# EAGLE schematic boardv2fpga (EAGLE 6.6.0)

## Sheet 1 of 11
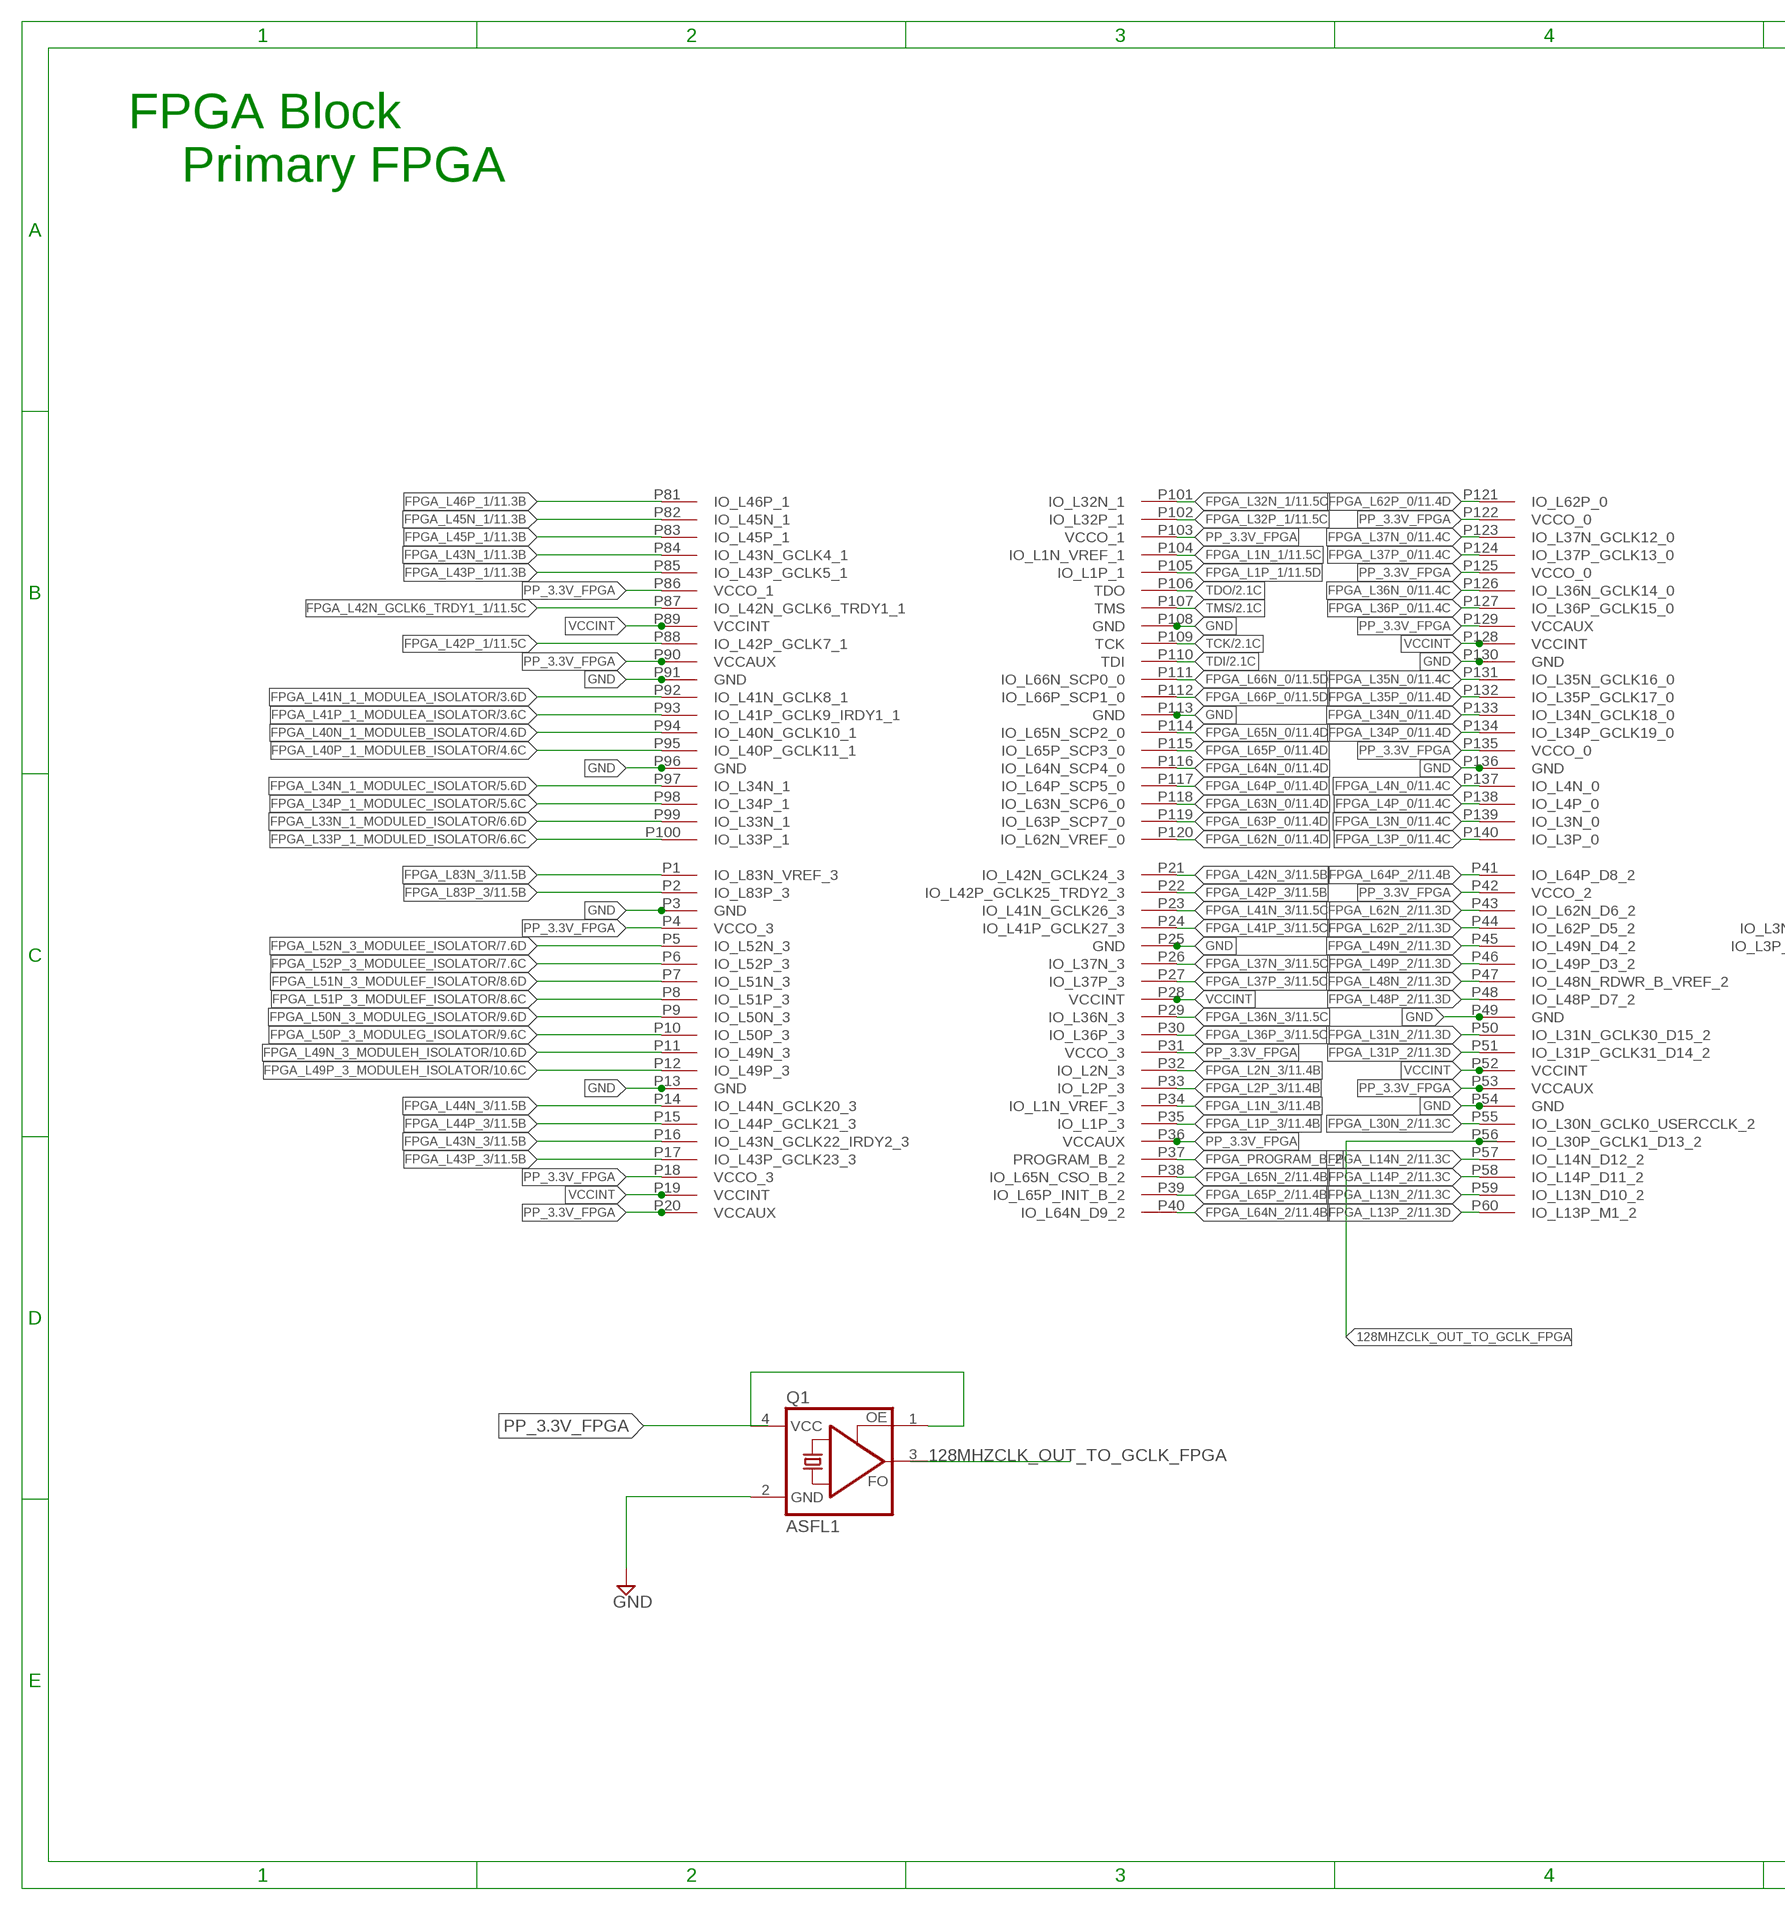
[diagram p0: schematic, sheet 1, part 1 of 2]
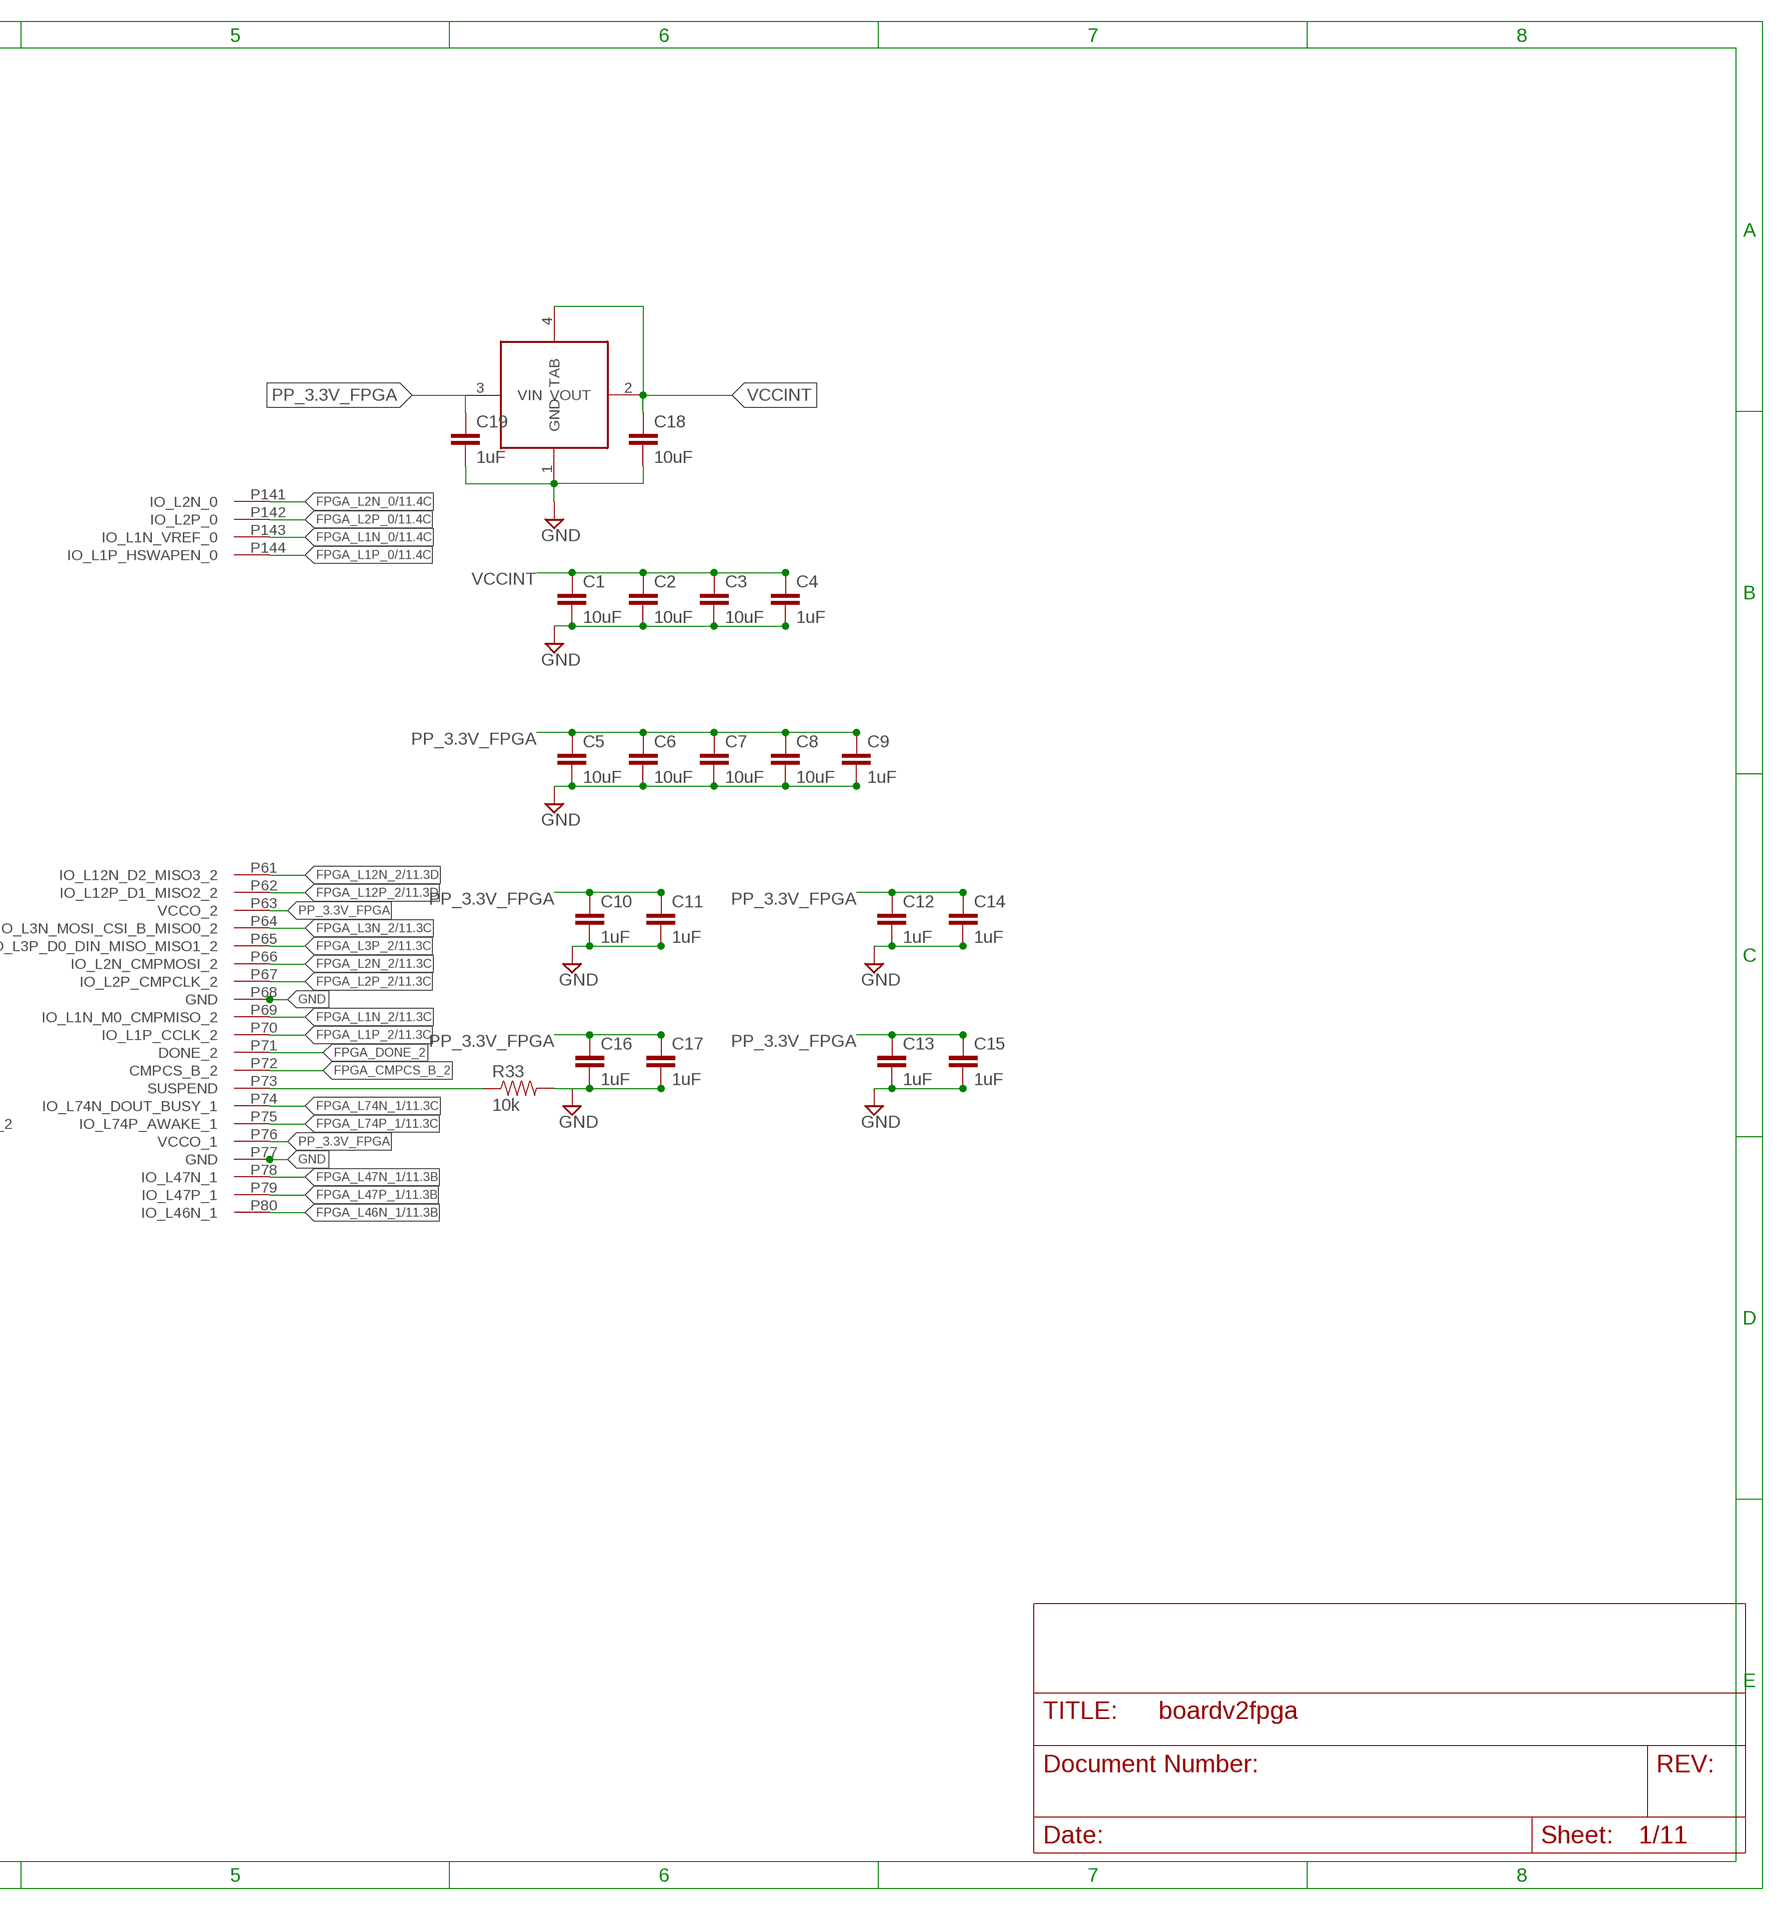
[diagram p1: schematic, sheet 1, part 2 of 2]

### Parts
C1  10uF  CAP0603-CAP  [0603-CAP]
C2  10uF  CAP0603-CAP  [0603-CAP]
C3  10uF  CAP0603-CAP  [0603-CAP]
C4  1uF  CAP0603-CAP  [0603-CAP]
C5  10uF  CAP0603-CAP  [0603-CAP]
C6  10uF  CAP0603-CAP  [0603-CAP]
C7  10uF  CAP0603-CAP  [0603-CAP]
C8  10uF  CAP0603-CAP  [0603-CAP]
C9  1uF  CAP0603-CAP  [0603-CAP]
C10  1uF  CAP0603-CAP  [0603-CAP]
C11  1uF  CAP0603-CAP  [0603-CAP]
C12  1uF  CAP0603-CAP  [0603-CAP]
C13  1uF  CAP0603-CAP  [0603-CAP]
C14  1uF  CAP0603-CAP  [0603-CAP]
C15  1uF  CAP0603-CAP  [0603-CAP]
C16  1uF  CAP0603-CAP  [0603-CAP]
C17  1uF  CAP0603-CAP  [0603-CAP]
C18  10uF  CAP0603-CAP  [0603-CAP]
C19  1uF  CAP0603-CAP  [0603-CAP]
Q1  ASFL1  [ASF]
R33  10k  RESISTOR0603-RES  [0603-RES]
U$1  XC6SLX4-2TQG144C  [TQ144]
U$3  1.2VREG  [SOT-223]

### Nets
128MHZCLK_OUT_TO_GCLK_FPGA: U$1.P56(IO_L30P_GCLK1_D13_2)
FPGA_CMPCS_B_2: U$1.P72(CMPCS_B_2)
FPGA_DONE_2: U$1.P71(DONE_2)
FPGA_L1N_0: U$1.P143(IO_L1N_VREF_0) ; also sheet 11
FPGA_L1N_1: U$1.P104(IO_L1N_VREF_1) ; also sheet 11
FPGA_L1N_2: U$1.P69(IO_L1N_M0_CMPMISO_2) ; also sheet 11
FPGA_L1N_3: U$1.P34(IO_L1N_VREF_3) ; also sheet 11
FPGA_L1P_0: U$1.P144(IO_L1P_HSWAPEN_0) ; also sheet 11
FPGA_L1P_1: U$1.P105(IO_L1P_1) ; also sheet 11
FPGA_L1P_2: U$1.P70(IO_L1P_CCLK_2) ; also sheet 11
FPGA_L1P_3: U$1.P35(IO_L1P_3) ; also sheet 11
FPGA_L2N_0: U$1.P141(IO_L2N_0) ; also sheet 11
FPGA_L2N_2: U$1.P66(IO_L2N_CMPMOSI_2) ; also sheet 11
FPGA_L2N_3: U$1.P32(IO_L2N_3) ; also sheet 11
FPGA_L2P_0: U$1.P142(IO_L2P_0) ; also sheet 11
FPGA_L2P_2: U$1.P67(IO_L2P_CMPCLK_2) ; also sheet 11
FPGA_L2P_3: U$1.P33(IO_L2P_3) ; also sheet 11
FPGA_L3N_0: U$1.P139(IO_L3N_0) ; also sheet 11
FPGA_L3N_2: U$1.P64(IO_L3N_MOSI_CSI_B_MISO0_2) ; also sheet 11
FPGA_L3P_0: U$1.P140(IO_L3P_0) ; also sheet 11
FPGA_L3P_2: U$1.P65(IO_L3P_D0_DIN_MISO_MISO1_2) ; also sheet 11
FPGA_L4N_0: U$1.P137(IO_L4N_0) ; also sheet 11
FPGA_L4P_0: U$1.P138(IO_L4P_0) ; also sheet 11
FPGA_L12N_2: U$1.P61(IO_L12N_D2_MISO3_2) ; also sheet 11
FPGA_L12P_2: U$1.P62(IO_L12P_D1_MISO2_2) ; also sheet 11
FPGA_L13N_2: U$1.P59(IO_L13N_D10_2) ; also sheet 11
FPGA_L13P_2: U$1.P60(IO_L13P_M1_2) ; also sheet 11
FPGA_L14N_2: U$1.P57(IO_L14N_D12_2) ; also sheet 11
FPGA_L14P_2: U$1.P58(IO_L14P_D11_2) ; also sheet 11
FPGA_L30N_2: U$1.P55(IO_L30N_GCLK0_USERCCLK_2) ; also sheet 11
FPGA_L31N_2: U$1.P50(IO_L31N_GCLK30_D15_2) ; also sheet 11
FPGA_L31P_2: U$1.P51(IO_L31P_GCLK31_D14_2) ; also sheet 11
FPGA_L32N_1: U$1.P101(IO_L32N_1) ; also sheet 11
FPGA_L32P_1: U$1.P102(IO_L32P_1) ; also sheet 11
FPGA_L33N_1_MODULED_ISOLATOR: U$1.P99(IO_L33N_1) ; also sheet 6
FPGA_L33P_1_MODULED_ISOLATOR: U$1.P100(IO_L33P_1) ; also sheet 6
FPGA_L34N_0: U$1.P133(IO_L34N_GCLK18_0) ; also sheet 11
FPGA_L34N_1_MODULEC_ISOLATOR: U$1.P97(IO_L34N_1) ; also sheet 5
FPGA_L34P_0: U$1.P134(IO_L34P_GCLK19_0) ; also sheet 11
FPGA_L34P_1_MODULEC_ISOLATOR: U$1.P98(IO_L34P_1) ; also sheet 5
FPGA_L35N_0: U$1.P131(IO_L35N_GCLK16_0) ; also sheet 11
FPGA_L35P_0: U$1.P132(IO_L35P_GCLK17_0) ; also sheet 11
FPGA_L36N_0: U$1.P126(IO_L36N_GCLK14_0) ; also sheet 11
FPGA_L36N_3: U$1.P29(IO_L36N_3) ; also sheet 11
FPGA_L36P_0: U$1.P127(IO_L36P_GCLK15_0) ; also sheet 11
FPGA_L36P_3: U$1.P30(IO_L36P_3) ; also sheet 11
FPGA_L37N_0: U$1.P123(IO_L37N_GCLK12_0) ; also sheet 11
FPGA_L37N_3: U$1.P26(IO_L37N_3) ; also sheet 11
FPGA_L37P_0: U$1.P124(IO_L37P_GCLK13_0) ; also sheet 11
FPGA_L37P_3: U$1.P27(IO_L37P_3) ; also sheet 11
FPGA_L40N_1_MODULEB_ISOLATOR: U$1.P94(IO_L40N_GCLK10_1) ; also sheet 4
FPGA_L40P_1_MODULEB_ISOLATOR: U$1.P95(IO_L40P_GCLK11_1) ; also sheet 4
FPGA_L41N_1_MODULEA_ISOLATOR: U$1.P92(IO_L41N_GCLK8_1) ; also sheet 3
FPGA_L41N_3: U$1.P23(IO_L41N_GCLK26_3) ; also sheet 11
FPGA_L41P_1_MODULEA_ISOLATOR: U$1.P93(IO_L41P_GCLK9_IRDY1_1) ; also sheet 3
FPGA_L41P_3: U$1.P24(IO_L41P_GCLK27_3) ; also sheet 11
FPGA_L42N_3: U$1.P21(IO_L42N_GCLK24_3) ; also sheet 11
FPGA_L42N_GCLK6_TRDY1_1: U$1.P87(IO_L42N_GCLK6_TRDY1_1) ; also sheet 11
FPGA_L42P_1: U$1.P88(IO_L42P_GCLK7_1) ; also sheet 11
FPGA_L42P_3: U$1.P22(IO_L42P_GCLK25_TRDY2_3) ; also sheet 11
FPGA_L43N_1: U$1.P84(IO_L43N_GCLK4_1) ; also sheet 11
FPGA_L43N_3: U$1.P16(IO_L43N_GCLK22_IRDY2_3) ; also sheet 11
FPGA_L43P_1: U$1.P85(IO_L43P_GCLK5_1) ; also sheet 11
FPGA_L43P_3: U$1.P17(IO_L43P_GCLK23_3) ; also sheet 11
FPGA_L44N_3: U$1.P14(IO_L44N_GCLK20_3) ; also sheet 11
FPGA_L44P_3: U$1.P15(IO_L44P_GCLK21_3) ; also sheet 11
FPGA_L45N_1: U$1.P82(IO_L45N_1) ; also sheet 11
FPGA_L45P_1: U$1.P83(IO_L45P_1) ; also sheet 11
FPGA_L46N_1: U$1.P80(IO_L46N_1) ; also sheet 11
FPGA_L46P_1: U$1.P81(IO_L46P_1) ; also sheet 11
FPGA_L47N_1: U$1.P78(IO_L47N_1) ; also sheet 11
FPGA_L47P_1: U$1.P79(IO_L47P_1) ; also sheet 11
FPGA_L48N_2: U$1.P47(IO_L48N_RDWR_B_VREF_2) ; also sheet 11
FPGA_L48P_2: U$1.P48(IO_L48P_D7_2) ; also sheet 11
FPGA_L49N_2: U$1.P45(IO_L49N_D4_2) ; also sheet 11
FPGA_L49N_3_MODULEH_ISOLATOR: U$1.P11(IO_L49N_3) ; also sheet 10
FPGA_L49P_2: U$1.P46(IO_L49P_D3_2) ; also sheet 11
FPGA_L49P_3_MODULEH_ISOLATOR: U$1.P12(IO_L49P_3) ; also sheet 10
FPGA_L50N_3_MODULEG_ISOLATOR: U$1.P9(IO_L50N_3) ; also sheet 9
FPGA_L50P_3_MODULEG_ISOLATOR: U$1.P10(IO_L50P_3) ; also sheet 9
FPGA_L51N_3_MODULEF_ISOLATOR: U$1.P7(IO_L51N_3) ; also sheet 8
FPGA_L51P_3_MODULEF_ISOLATOR: U$1.P8(IO_L51P_3) ; also sheet 8
FPGA_L52N_3_MODULEE_ISOLATOR: U$1.P5(IO_L52N_3) ; also sheet 7
FPGA_L52P_3_MODULEE_ISOLATOR: U$1.P6(IO_L52P_3) ; also sheet 7
FPGA_L62N_0: U$1.P120(IO_L62N_VREF_0) ; also sheet 11
FPGA_L62N_2: U$1.P43(IO_L62N_D6_2) ; also sheet 11
FPGA_L62P_0: U$1.P121(IO_L62P_0) ; also sheet 11
FPGA_L62P_2: U$1.P44(IO_L62P_D5_2) ; also sheet 11
FPGA_L63N_0: U$1.P118(IO_L63N_SCP6_0) ; also sheet 11
FPGA_L63P_0: U$1.P119(IO_L63P_SCP7_0) ; also sheet 11
FPGA_L64N_0: U$1.P116(IO_L64N_SCP4_0) ; also sheet 11
FPGA_L64N_2: U$1.P40(IO_L64N_D9_2) ; also sheet 11
FPGA_L64P_0: U$1.P117(IO_L64P_SCP5_0) ; also sheet 11
FPGA_L64P_2: U$1.P41(IO_L64P_D8_2) ; also sheet 11
FPGA_L65N_0: U$1.P114(IO_L65N_SCP2_0) ; also sheet 11
FPGA_L65N_2: U$1.P38(IO_L65N_CSO_B_2) ; also sheet 11
FPGA_L65P_0: U$1.P115(IO_L65P_SCP3_0) ; also sheet 11
FPGA_L65P_2: U$1.P39(IO_L65P_INIT_B_2) ; also sheet 11
FPGA_L66N_0: U$1.P111(IO_L66N_SCP0_0) ; also sheet 11
FPGA_L66P_0: U$1.P112(IO_L66P_SCP1_0) ; also sheet 11
FPGA_L74N_1: U$1.P74(IO_L74N_DOUT_BUSY_1) ; also sheet 11
FPGA_L74P_1: U$1.P75(IO_L74P_AWAKE_1) ; also sheet 11
FPGA_L83N_3: U$1.P1(IO_L83N_VREF_3) ; also sheet 11
FPGA_L83P_3: U$1.P2(IO_L83P_3) ; also sheet 11
FPGA_PROGRAM_B_2: U$1.P37(PROGRAM_B_2)
FPGA_SUSPEND: R33.1 U$1.P73(SUSPEND)
GND: C1.2 C2.2 C3.2 C4.2 C5.2 C6.2 C7.2 C8.2 C9.2 C10.2 C11.2 C12.2 C13.2 C14.2 C15.2 C16.2 C17.2 C18.2 C19.2 Q1.2(GND) R33.2 U$1.P3(GND) U$1.P13(GND) U$1.P25(GND) U$1.P49(GND) U$1.P54(GND) U$1.P68(GND) U$1.P77(GND) U$1.P91(GND) U$1.P96(GND) U$1.P108(GND) U$1.P113(GND) U$1.P130(GND) U$1.P136(GND) U$3.1(GND) ; also sheet 2,3,4,5,6,7,8,9,10
PP_3.3V_FPGA: C5.1 C6.1 C7.1 C8.1 C9.1 C10.1 C11.1 C12.1 C13.1 C14.1 C15.1 C16.1 C17.1 C19.1 Q1.1(OE) U$1.P4(VCCO_3) U$1.P18(VCCO_3) U$1.P20(VCCAUX) U$1.P31(VCCO_3) U$1.P36(VCCAUX) U$1.P42(VCCO_2) U$1.P53(VCCAUX) U$1.P63(VCCO_2) U$1.P76(VCCO_1) U$1.P86(VCCO_1) U$1.P90(VCCAUX) U$1.P103(VCCO_1) U$1.P122(VCCO_0) U$1.P125(VCCO_0) U$1.P129(VCCAUX) U$1.P135(VCCO_0) U$3.3(VIN)
TCK: U$1.P109(TCK) ; also sheet 2
TDI: U$1.P110(TDI) ; also sheet 2
TDO: U$1.P106(TDO) ; also sheet 2
TMS: U$1.P107(TMS) ; also sheet 2
VCCINT: C1.1 C2.1 C3.1 C4.1 C18.1 U$1.P19(VCCINT) U$1.P28(VCCINT) U$1.P52(VCCINT) U$1.P89(VCCINT) U$1.P128(VCCINT) U$3.2(VOUT) U$3.4(TAB)
Unconnected: Q1.3(FO)

### Notes on the sheet
- FPGA Block
- Primary FPGA

## Sheet 2 of 11
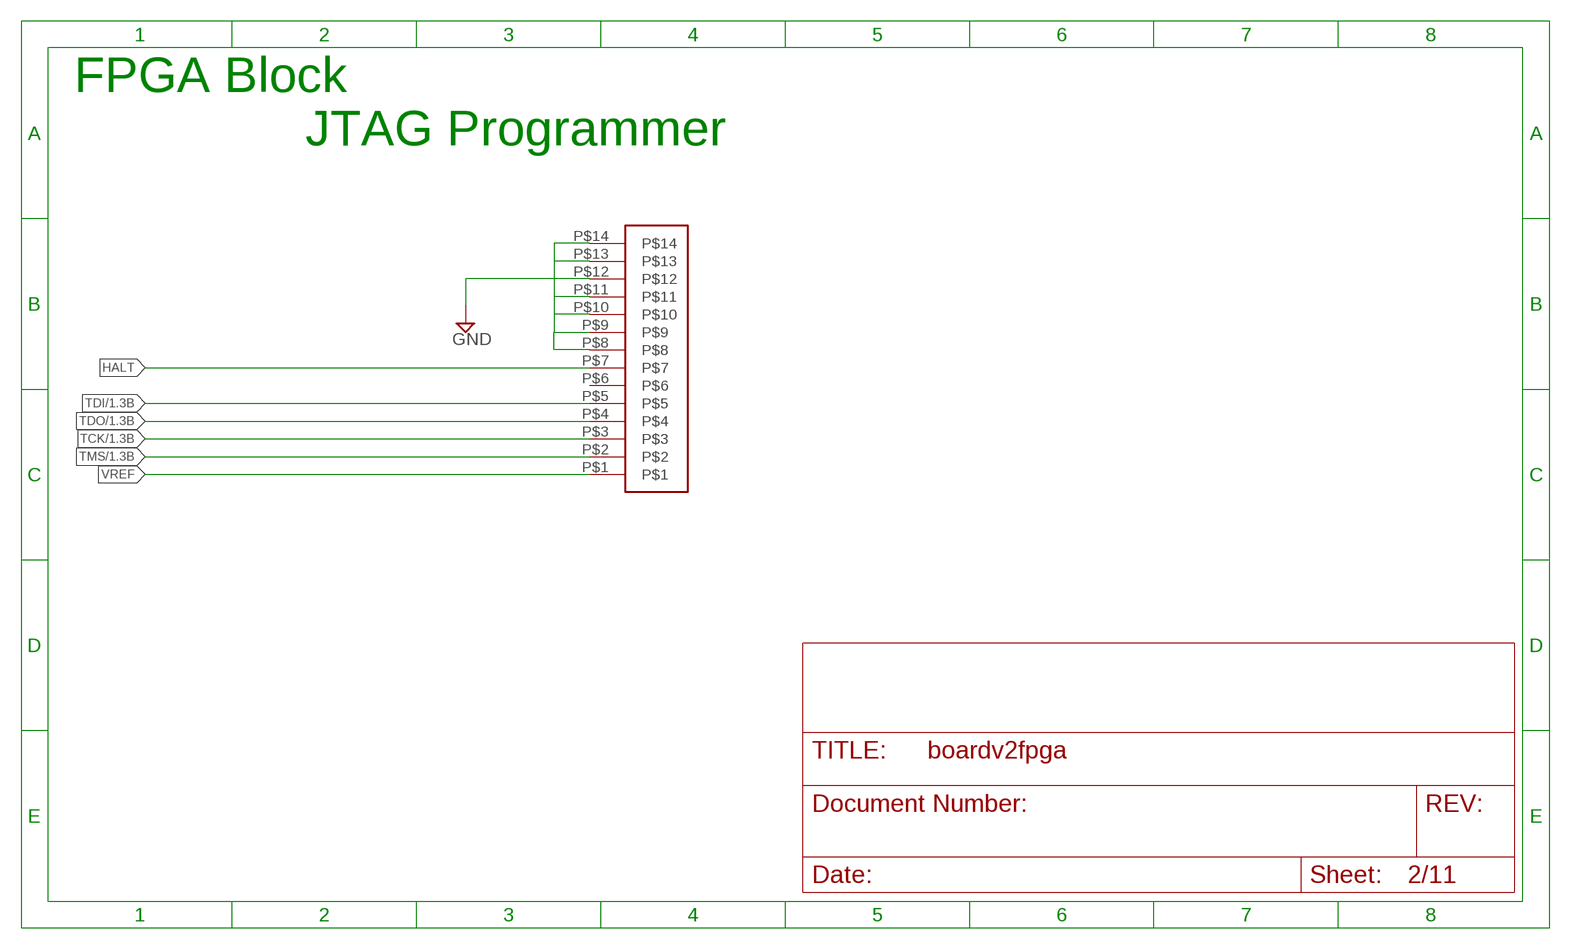
[diagram p2: schematic, sheet 2]

### Parts
U$2  JTAG14PIN  [JTAG14PIN]

### Nets
GND: U$2.P$8 U$2.P$9 U$2.P$10 U$2.P$11 U$2.P$12 U$2.P$13 U$2.P$14 ; also sheet 1,3,4,5,6,7,8,9,10
HALT: U$2.P$7
TCK: U$2.P$3 ; also sheet 1
TDI: U$2.P$5 ; also sheet 1
TDO: U$2.P$4 ; also sheet 1
TMS: U$2.P$2 ; also sheet 1
VREF: U$2.P$1
Unconnected: U$2.P$6

### Notes on the sheet
- FPGA Block
- JTAG Programmer

## Sheet 3 of 11
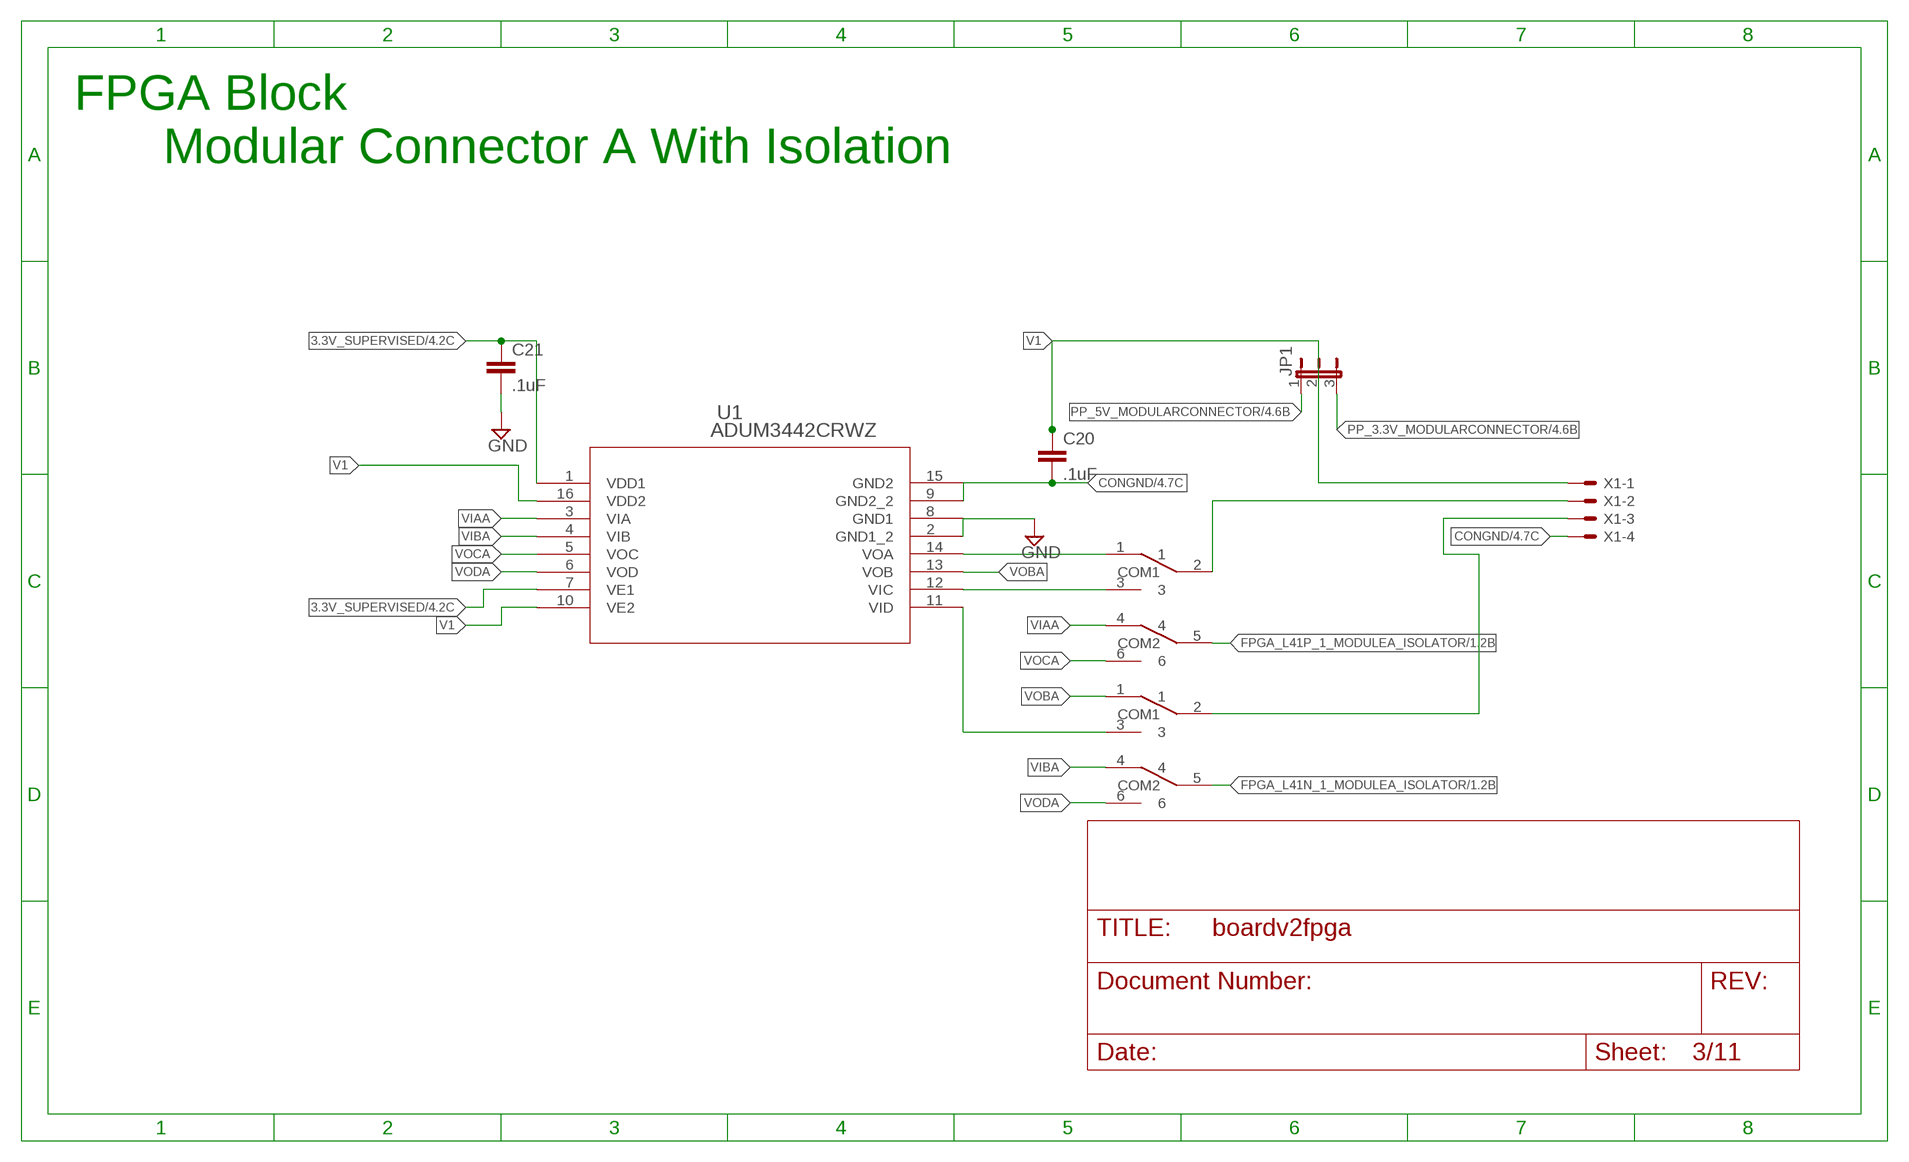
[diagram p3: schematic, sheet 3]

### Parts
C20  .1uF  CAP0603-CAP  [0603-CAP]
C21  .1uF  CAP0603-CAP  [0603-CAP]
JP1  JP2E  [JP2]
U1  ADUM3442CRWZ  [RW_16]
U$4  DPDTSWITCH  [JS202011]
U$5  DPDTSWITCH  [JS202011]
X1  KK-156-4  [KK-156-4]

### Nets
3.3V_SUPERVISED: C21.1 U1.1(VDD1) U1.7(VE1) ; also sheet 4,5,6,7,8,9,10
CONGND: C20.2 U1.9(GND2_2) U1.15(GND2) X1.4 ; also sheet 4,5,6,7,8,9,10
FPGA_L41N_1_MODULEA_ISOLATOR: U$4.5(COM2) ; also sheet 1
FPGA_L41P_1_MODULEA_ISOLATOR: U$5.5(COM2) ; also sheet 1
GND: C21.2 U1.2(GND1_2) U1.8(GND1) ; also sheet 1,2,4,5,6,7,8,9,10
N$2: U$5.2(COM1) X1.2
N$3: U1.14(VOA) U$5.1
N$4: U1.12(VIC) U$5.3
N$5: U1.11(VID) U$4.3
N$6: U$4.2(COM1) X1.3
PP_3.3V_MODULARCONNECTOR: JP1.3 ; also sheet 4,5,6,7,8,9,10
PP_5V_MODULARCONNECTOR: JP1.1 ; also sheet 4,5,6,7,8,9,10
V1: C20.1 JP1.2 U1.10(VE2) U1.16(VDD2) X1.1
VIAA: U1.3(VIA) U$5.4
VIBA: U1.4(VIB) U$4.4
VOBA: U1.13(VOB) U$4.1
VOCA: U1.5(VOC) U$5.6
VODA: U1.6(VOD) U$4.6

### Notes on the sheet
- FPGA Block
- Modular Connector A With Isolation

## Sheet 4 of 11
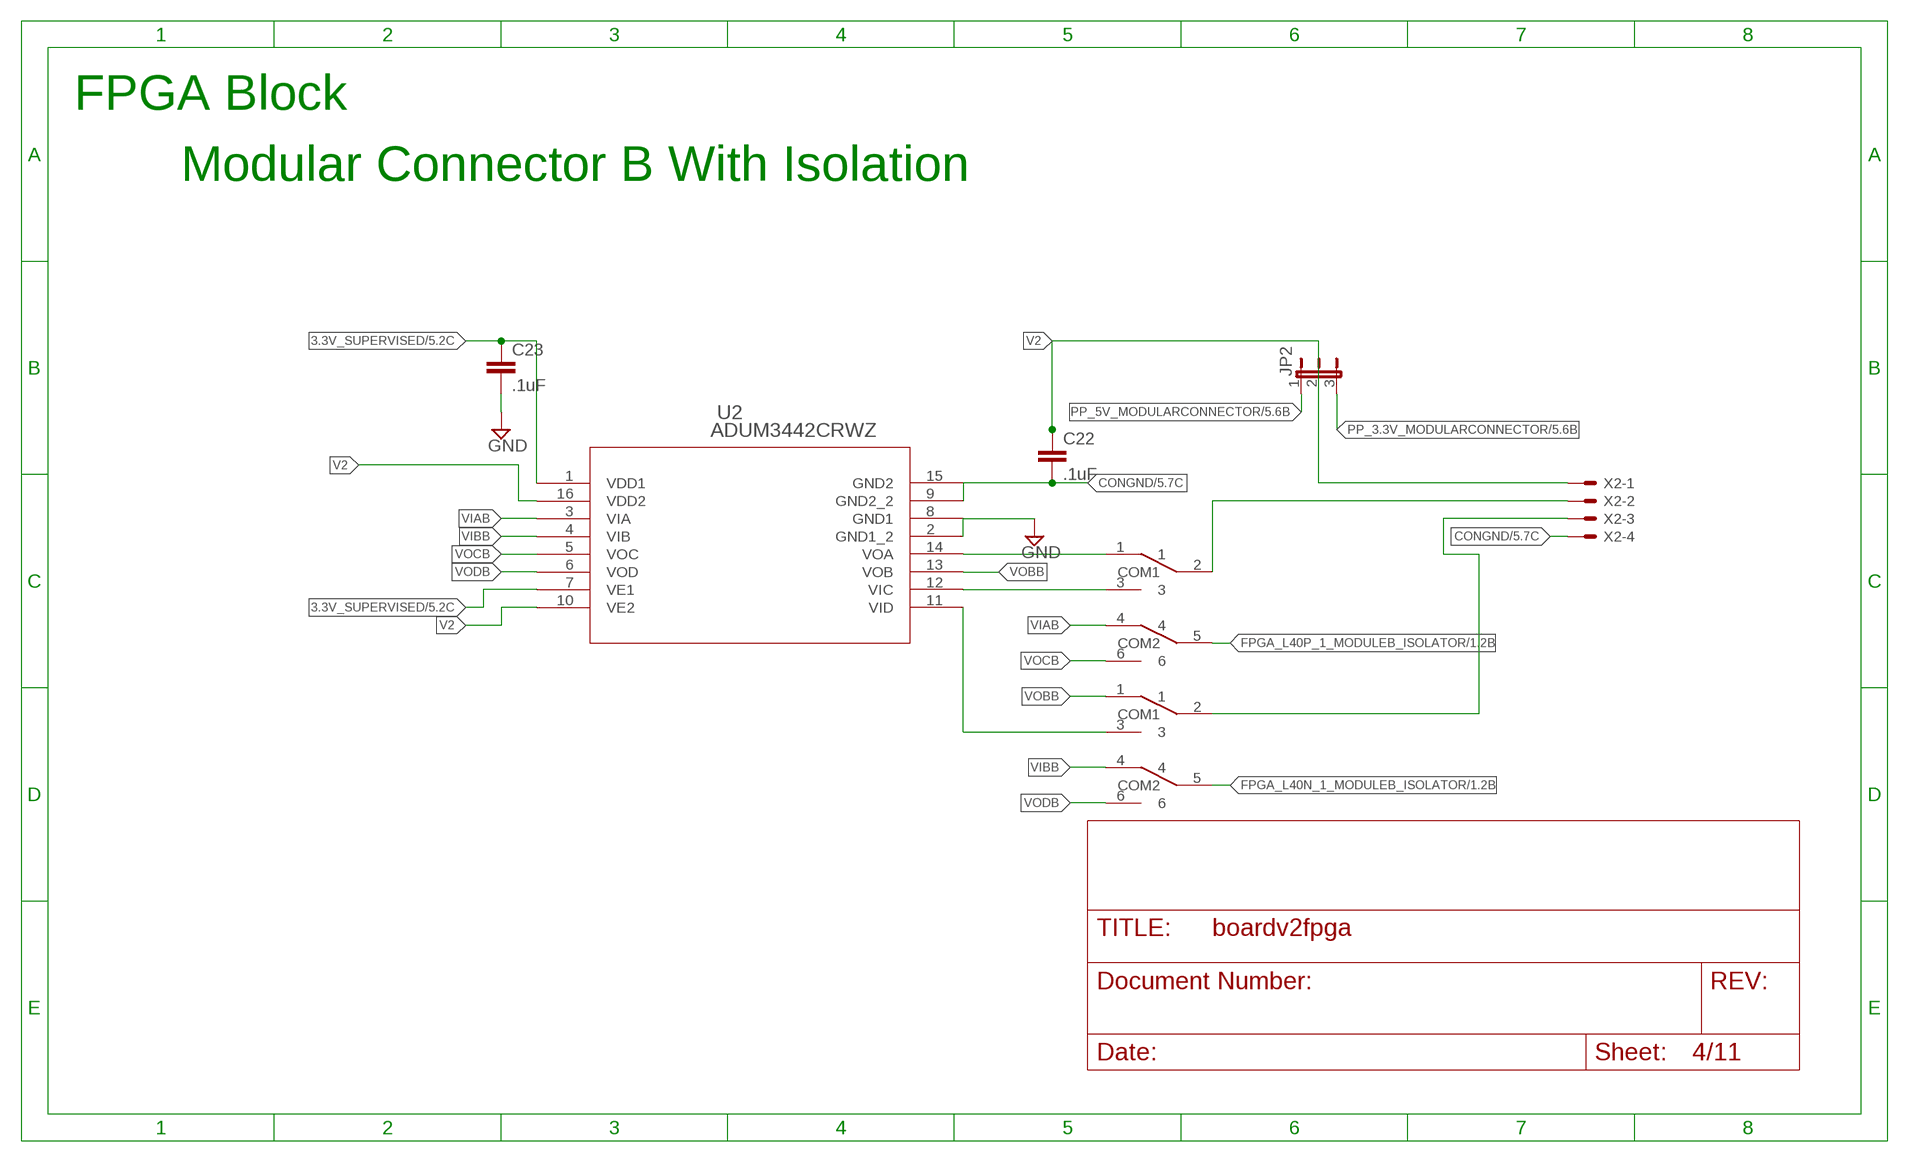
[diagram p4: schematic, sheet 4]

### Parts
C22  .1uF  CAP0603-CAP  [0603-CAP]
C23  .1uF  CAP0603-CAP  [0603-CAP]
JP2  JP2E  [JP2]
U2  ADUM3442CRWZ  [RW_16]
U$6  DPDTSWITCH  [JS202011]
U$7  DPDTSWITCH  [JS202011]
X2  KK-156-4  [KK-156-4]

### Nets
3.3V_SUPERVISED: C23.1 U2.1(VDD1) U2.7(VE1) ; also sheet 3,5,6,7,8,9,10
CONGND: C22.2 U2.9(GND2_2) U2.15(GND2) X2.4 ; also sheet 3,5,6,7,8,9,10
FPGA_L40N_1_MODULEB_ISOLATOR: U$6.5(COM2) ; also sheet 1
FPGA_L40P_1_MODULEB_ISOLATOR: U$7.5(COM2) ; also sheet 1
GND: C23.2 U2.2(GND1_2) U2.8(GND1) ; also sheet 1,2,3,5,6,7,8,9,10
N$1: U$7.2(COM1) X2.2
N$7: U$6.2(COM1) X2.3
N$8: U2.14(VOA) U$7.1
N$9: U2.12(VIC) U$7.3
N$10: U2.11(VID) U$6.3
PP_3.3V_MODULARCONNECTOR: JP2.3 ; also sheet 3,5,6,7,8,9,10
PP_5V_MODULARCONNECTOR: JP2.1 ; also sheet 3,5,6,7,8,9,10
V2: C22.1 JP2.2 U2.10(VE2) U2.16(VDD2) X2.1
VIAB: U2.3(VIA) U$7.4
VIBB: U2.4(VIB) U$6.4
VOBB: U2.13(VOB) U$6.1
VOCB: U2.5(VOC) U$7.6
VODB: U2.6(VOD) U$6.6

### Notes on the sheet
- FPGA Block
- Modular Connector B With Isolation

## Sheet 5 of 11
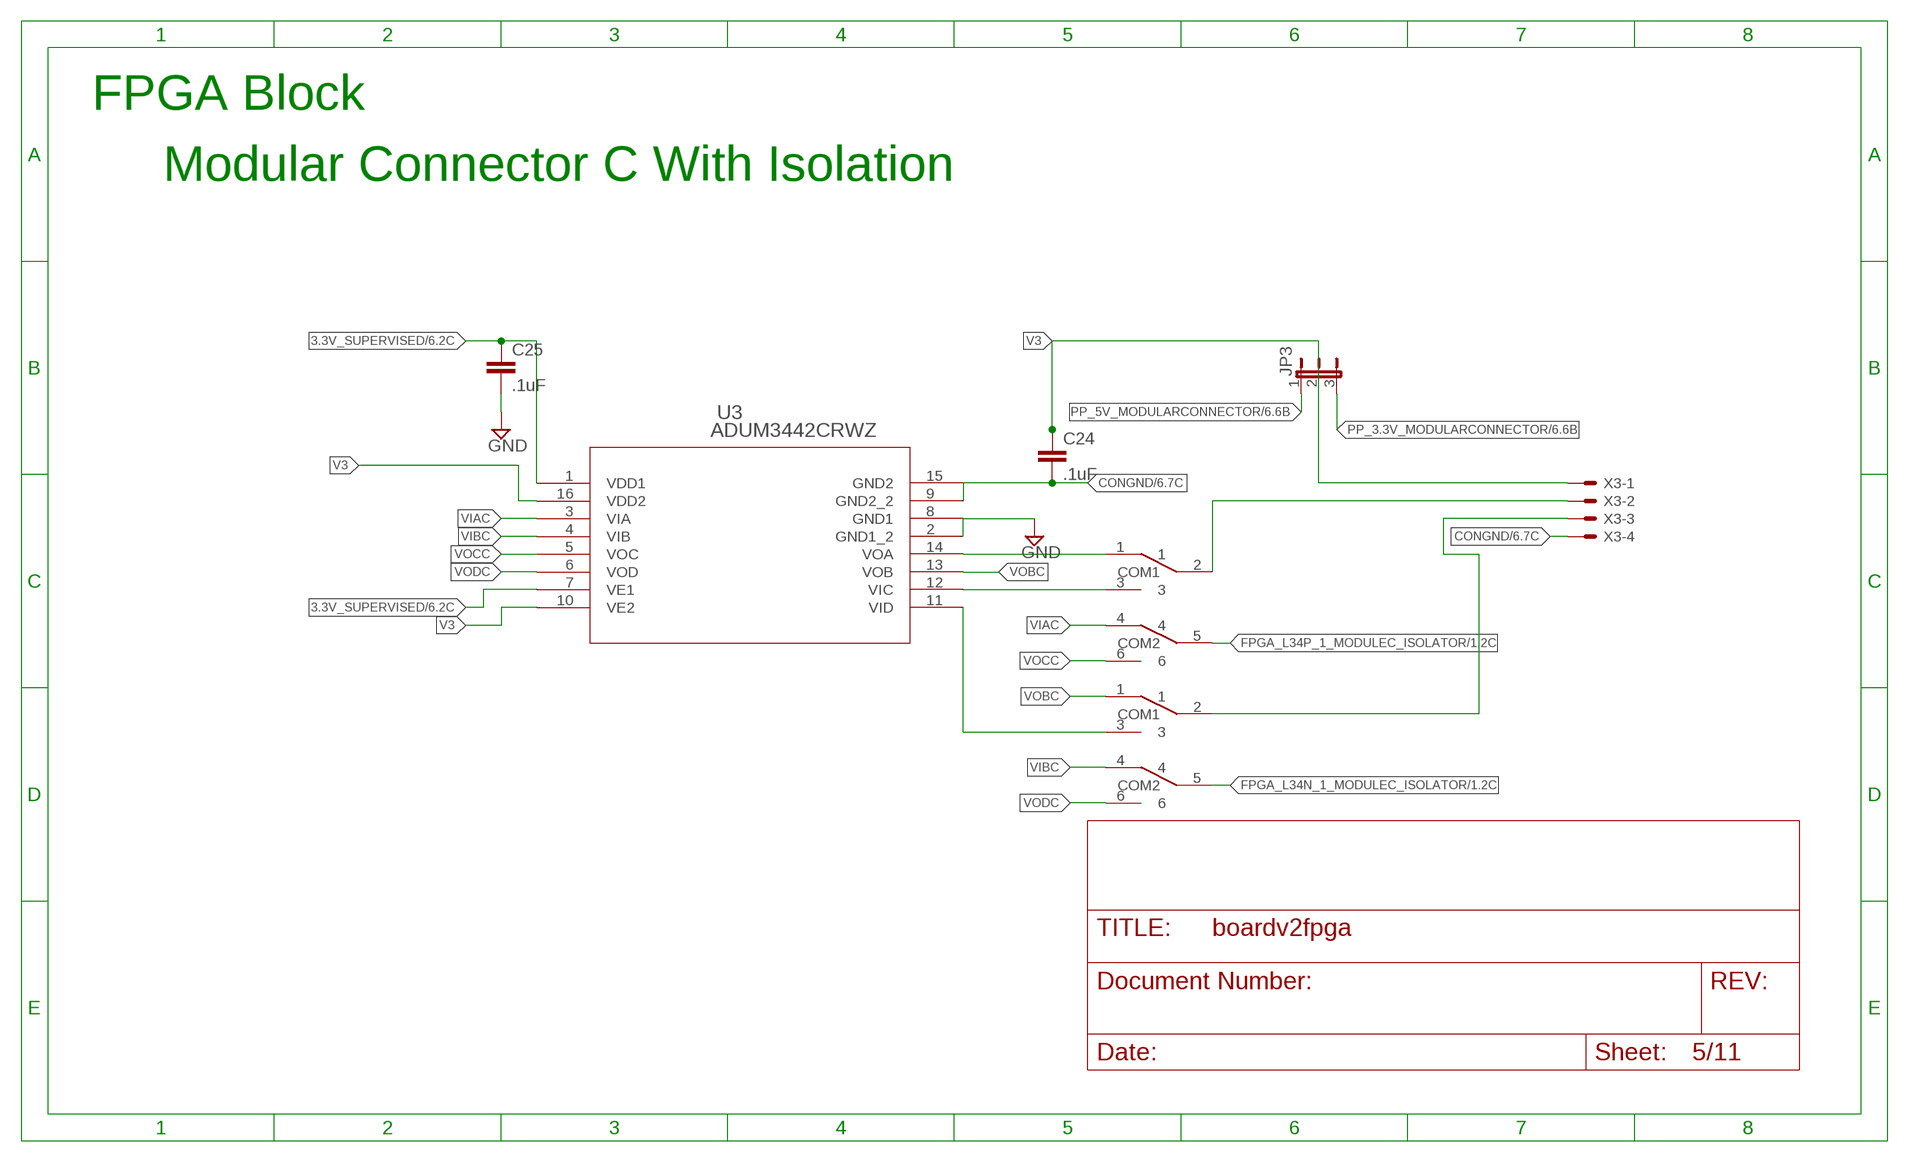
[diagram p5: schematic, sheet 5]

### Parts
C24  .1uF  CAP0603-CAP  [0603-CAP]
C25  .1uF  CAP0603-CAP  [0603-CAP]
JP3  JP2E  [JP2]
U3  ADUM3442CRWZ  [RW_16]
U$8  DPDTSWITCH  [JS202011]
U$9  DPDTSWITCH  [JS202011]
X3  KK-156-4  [KK-156-4]

### Nets
3.3V_SUPERVISED: C25.1 U3.1(VDD1) U3.7(VE1) ; also sheet 3,4,6,7,8,9,10
CONGND: C24.2 U3.9(GND2_2) U3.15(GND2) X3.4 ; also sheet 3,4,6,7,8,9,10
FPGA_L34N_1_MODULEC_ISOLATOR: U$8.5(COM2) ; also sheet 1
FPGA_L34P_1_MODULEC_ISOLATOR: U$9.5(COM2) ; also sheet 1
GND: C25.2 U3.2(GND1_2) U3.8(GND1) ; also sheet 1,2,3,4,6,7,8,9,10
N$11: U$9.2(COM1) X3.2
N$12: U$8.2(COM1) X3.3
N$13: U3.14(VOA) U$9.1
N$14: U3.12(VIC) U$9.3
N$15: U3.11(VID) U$8.3
PP_3.3V_MODULARCONNECTOR: JP3.3 ; also sheet 3,4,6,7,8,9,10
PP_5V_MODULARCONNECTOR: JP3.1 ; also sheet 3,4,6,7,8,9,10
V3: C24.1 JP3.2 U3.10(VE2) U3.16(VDD2) X3.1
VIAC: U3.3(VIA) U$9.4
VIBC: U3.4(VIB) U$8.4
VOBC: U3.13(VOB) U$8.1
VOCC: U3.5(VOC) U$9.6
VODC: U3.6(VOD) U$8.6

### Notes on the sheet
- FPGA Block
- Modular Connector C With Isolation

## Sheet 6 of 11
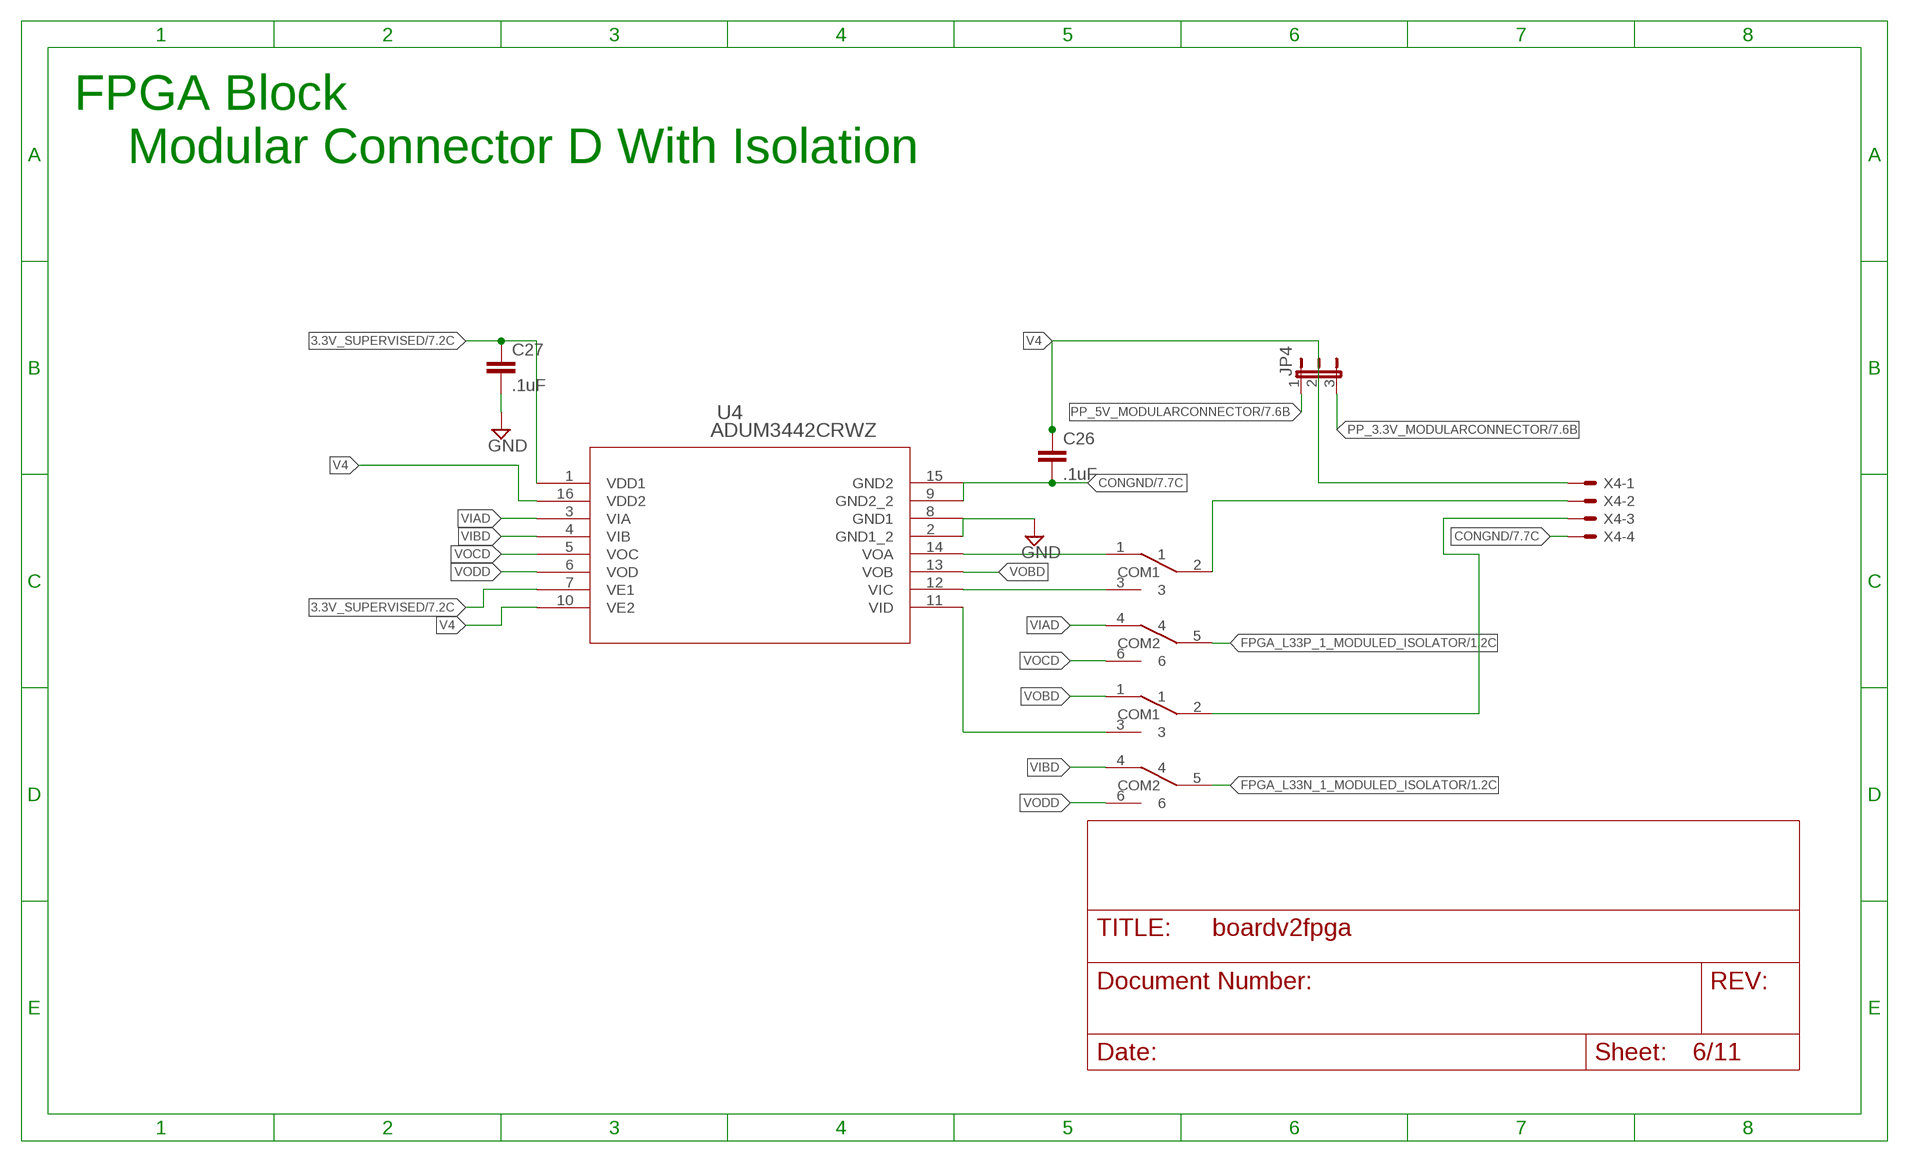
[diagram p6: schematic, sheet 6]

### Parts
C26  .1uF  CAP0603-CAP  [0603-CAP]
C27  .1uF  CAP0603-CAP  [0603-CAP]
JP4  JP2E  [JP2]
U4  ADUM3442CRWZ  [RW_16]
U$10  DPDTSWITCH  [JS202011]
U$11  DPDTSWITCH  [JS202011]
X4  KK-156-4  [KK-156-4]

### Nets
3.3V_SUPERVISED: C27.1 U4.1(VDD1) U4.7(VE1) ; also sheet 3,4,5,7,8,9,10
CONGND: C26.2 U4.9(GND2_2) U4.15(GND2) X4.4 ; also sheet 3,4,5,7,8,9,10
FPGA_L33N_1_MODULED_ISOLATOR: U$10.5(COM2) ; also sheet 1
FPGA_L33P_1_MODULED_ISOLATOR: U$11.5(COM2) ; also sheet 1
GND: C27.2 U4.2(GND1_2) U4.8(GND1) ; also sheet 1,2,3,4,5,7,8,9,10
N$16: U$11.2(COM1) X4.2
N$17: U$10.2(COM1) X4.3
N$18: U4.14(VOA) U$11.1
N$19: U4.12(VIC) U$11.3
N$20: U4.11(VID) U$10.3
PP_3.3V_MODULARCONNECTOR: JP4.3 ; also sheet 3,4,5,7,8,9,10
PP_5V_MODULARCONNECTOR: JP4.1 ; also sheet 3,4,5,7,8,9,10
V4: C26.1 JP4.2 U4.10(VE2) U4.16(VDD2) X4.1
VIAD: U4.3(VIA) U$11.4
VIBD: U4.4(VIB) U$10.4
VOBD: U4.13(VOB) U$10.1
VOCD: U4.5(VOC) U$11.6
VODD: U4.6(VOD) U$10.6

### Notes on the sheet
- FPGA Block
- Modular Connector D With Isolation

## Sheet 7 of 11
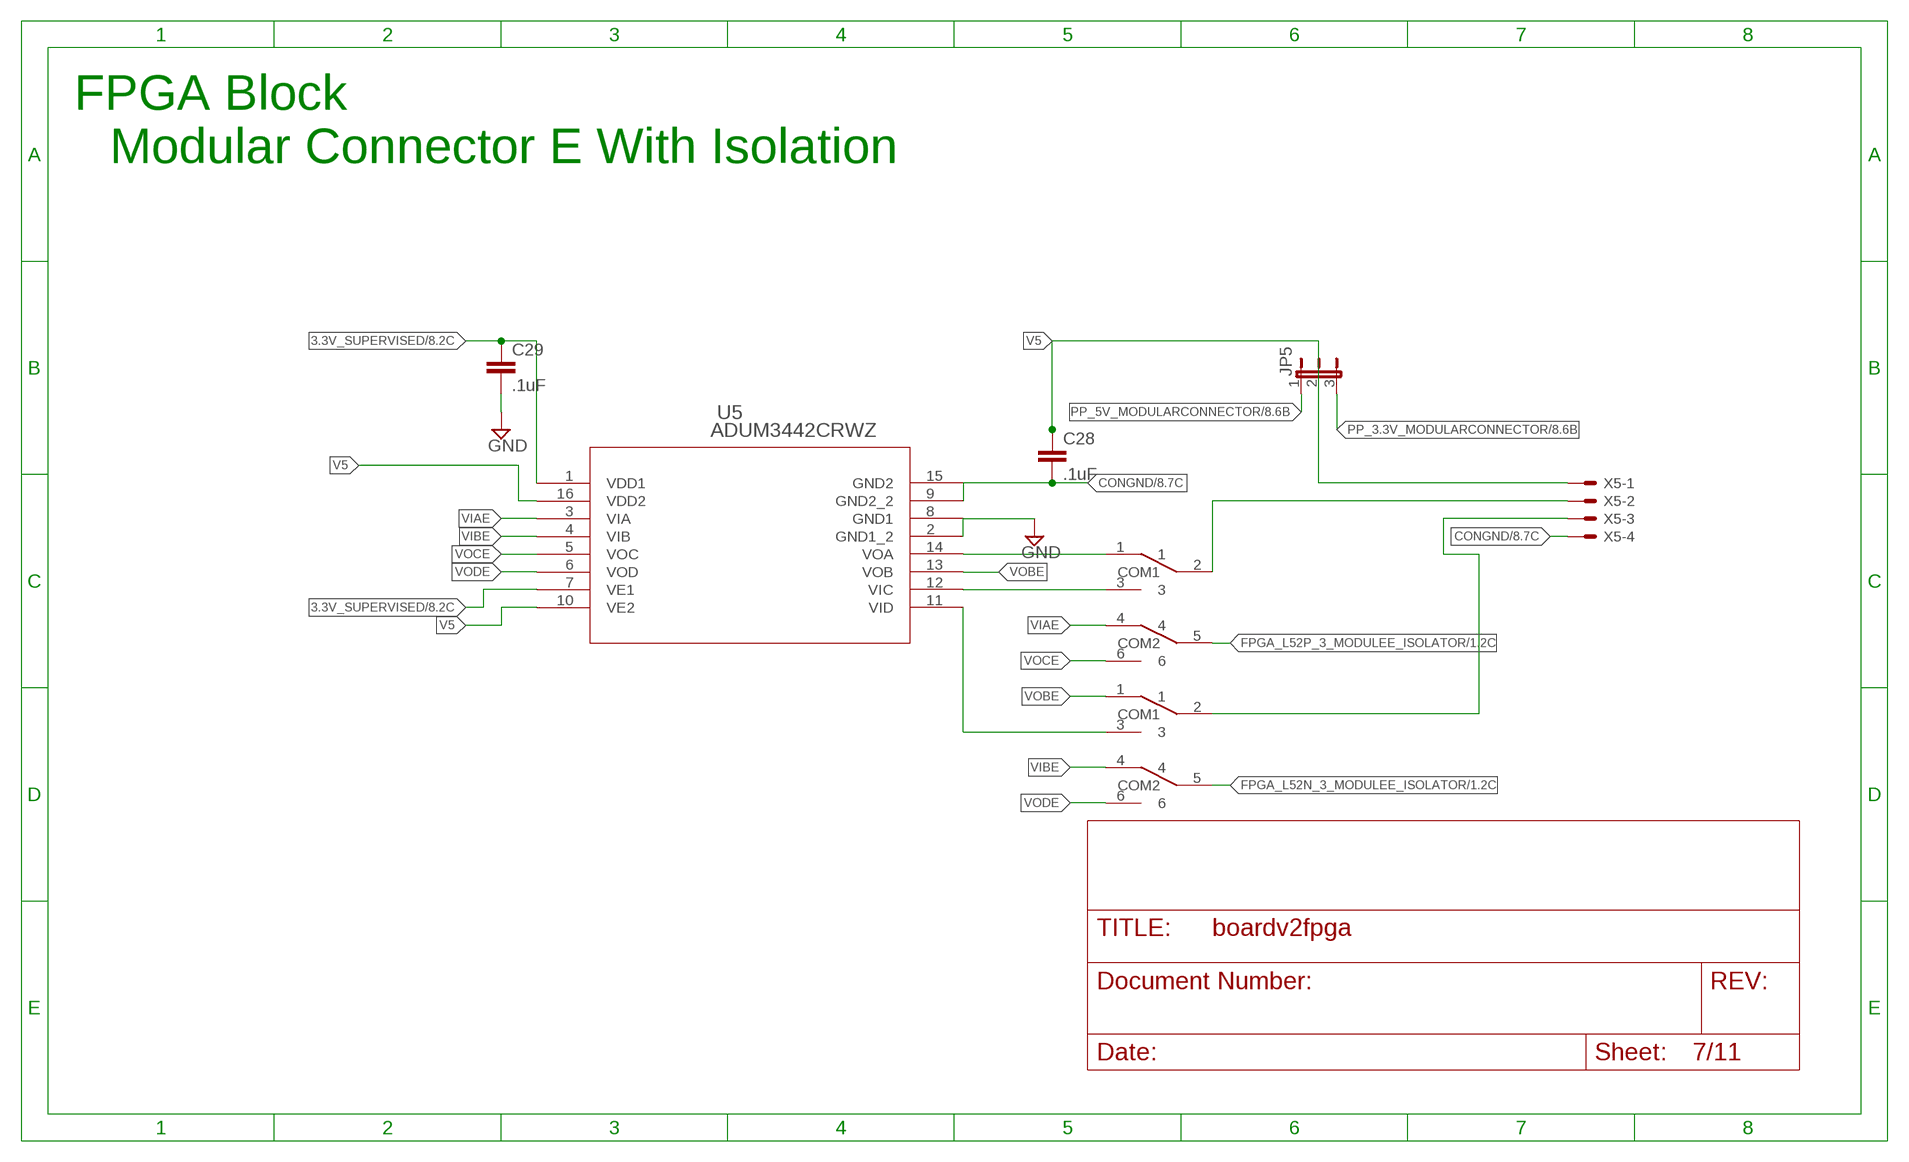
[diagram p7: schematic, sheet 7]

### Parts
C28  .1uF  CAP0603-CAP  [0603-CAP]
C29  .1uF  CAP0603-CAP  [0603-CAP]
JP5  JP2E  [JP2]
U5  ADUM3442CRWZ  [RW_16]
U$12  DPDTSWITCH  [JS202011]
U$13  DPDTSWITCH  [JS202011]
X5  KK-156-4  [KK-156-4]

### Nets
3.3V_SUPERVISED: C29.1 U5.1(VDD1) U5.7(VE1) ; also sheet 3,4,5,6,8,9,10
CONGND: C28.2 U5.9(GND2_2) U5.15(GND2) X5.4 ; also sheet 3,4,5,6,8,9,10
FPGA_L52N_3_MODULEE_ISOLATOR: U$12.5(COM2) ; also sheet 1
FPGA_L52P_3_MODULEE_ISOLATOR: U$13.5(COM2) ; also sheet 1
GND: C29.2 U5.2(GND1_2) U5.8(GND1) ; also sheet 1,2,3,4,5,6,8,9,10
N$21: U$13.2(COM1) X5.2
N$22: U$12.2(COM1) X5.3
N$23: U5.14(VOA) U$13.1
N$24: U5.12(VIC) U$13.3
N$25: U5.11(VID) U$12.3
PP_3.3V_MODULARCONNECTOR: JP5.3 ; also sheet 3,4,5,6,8,9,10
PP_5V_MODULARCONNECTOR: JP5.1 ; also sheet 3,4,5,6,8,9,10
V5: C28.1 JP5.2 U5.10(VE2) U5.16(VDD2) X5.1
VIAE: U5.3(VIA) U$13.4
VIBE: U5.4(VIB) U$12.4
VOBE: U5.13(VOB) U$12.1
VOCE: U5.5(VOC) U$13.6
VODE: U5.6(VOD) U$12.6

### Notes on the sheet
- FPGA Block
- Modular Connector E With Isolation

## Sheet 8 of 11
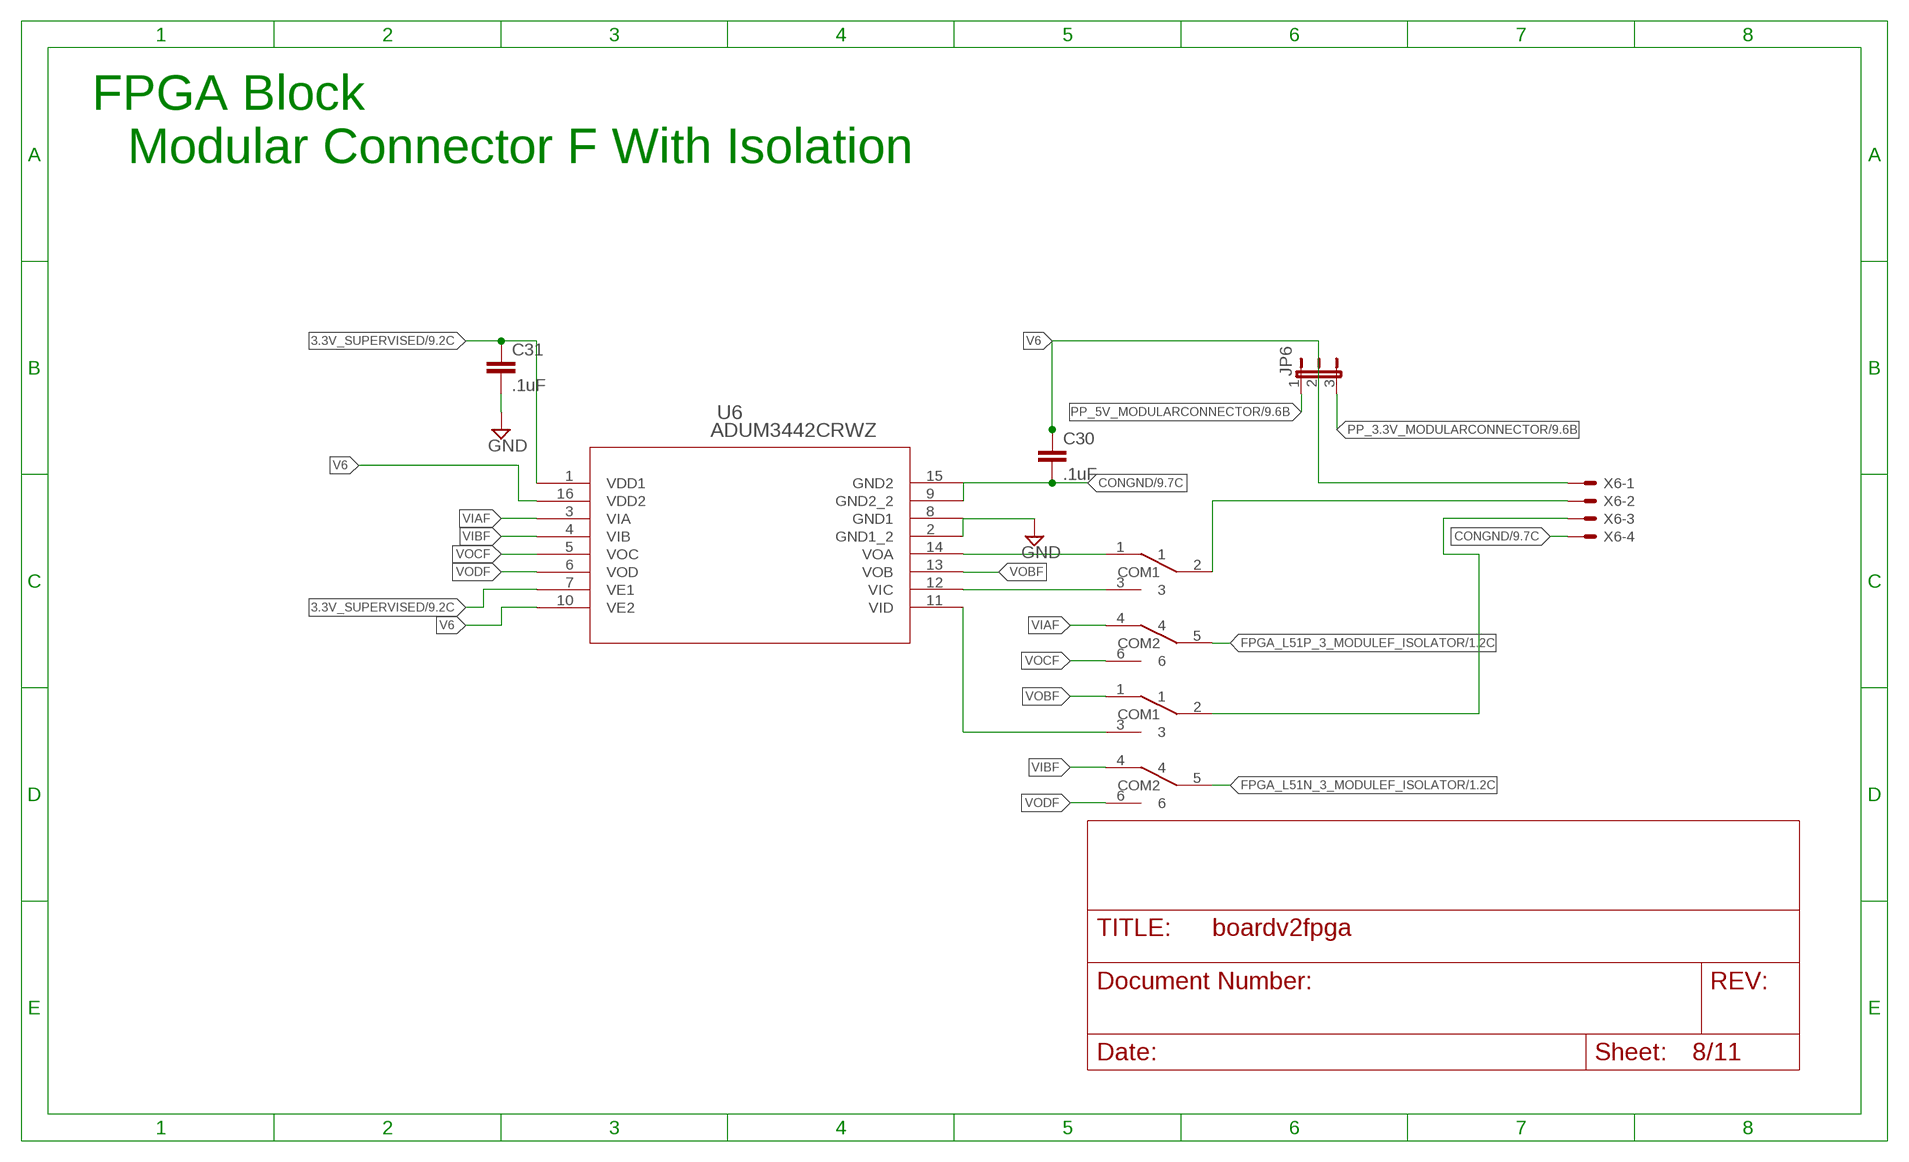
[diagram p8: schematic, sheet 8]

### Parts
C30  .1uF  CAP0603-CAP  [0603-CAP]
C31  .1uF  CAP0603-CAP  [0603-CAP]
JP6  JP2E  [JP2]
U6  ADUM3442CRWZ  [RW_16]
U$14  DPDTSWITCH  [JS202011]
U$15  DPDTSWITCH  [JS202011]
X6  KK-156-4  [KK-156-4]

### Nets
3.3V_SUPERVISED: C31.1 U6.1(VDD1) U6.7(VE1) ; also sheet 3,4,5,6,7,9,10
CONGND: C30.2 U6.9(GND2_2) U6.15(GND2) X6.4 ; also sheet 3,4,5,6,7,9,10
FPGA_L51N_3_MODULEF_ISOLATOR: U$14.5(COM2) ; also sheet 1
FPGA_L51P_3_MODULEF_ISOLATOR: U$15.5(COM2) ; also sheet 1
GND: C31.2 U6.2(GND1_2) U6.8(GND1) ; also sheet 1,2,3,4,5,6,7,9,10
N$26: U$15.2(COM1) X6.2
N$27: U$14.2(COM1) X6.3
N$28: U6.14(VOA) U$15.1
N$29: U6.12(VIC) U$15.3
N$30: U6.11(VID) U$14.3
PP_3.3V_MODULARCONNECTOR: JP6.3 ; also sheet 3,4,5,6,7,9,10
PP_5V_MODULARCONNECTOR: JP6.1 ; also sheet 3,4,5,6,7,9,10
V6: C30.1 JP6.2 U6.10(VE2) U6.16(VDD2) X6.1
VIAF: U6.3(VIA) U$15.4
VIBF: U6.4(VIB) U$14.4
VOBF: U6.13(VOB) U$14.1
VOCF: U6.5(VOC) U$15.6
VODF: U6.6(VOD) U$14.6

### Notes on the sheet
- FPGA Block
- Modular Connector F With Isolation

## Sheet 9 of 11
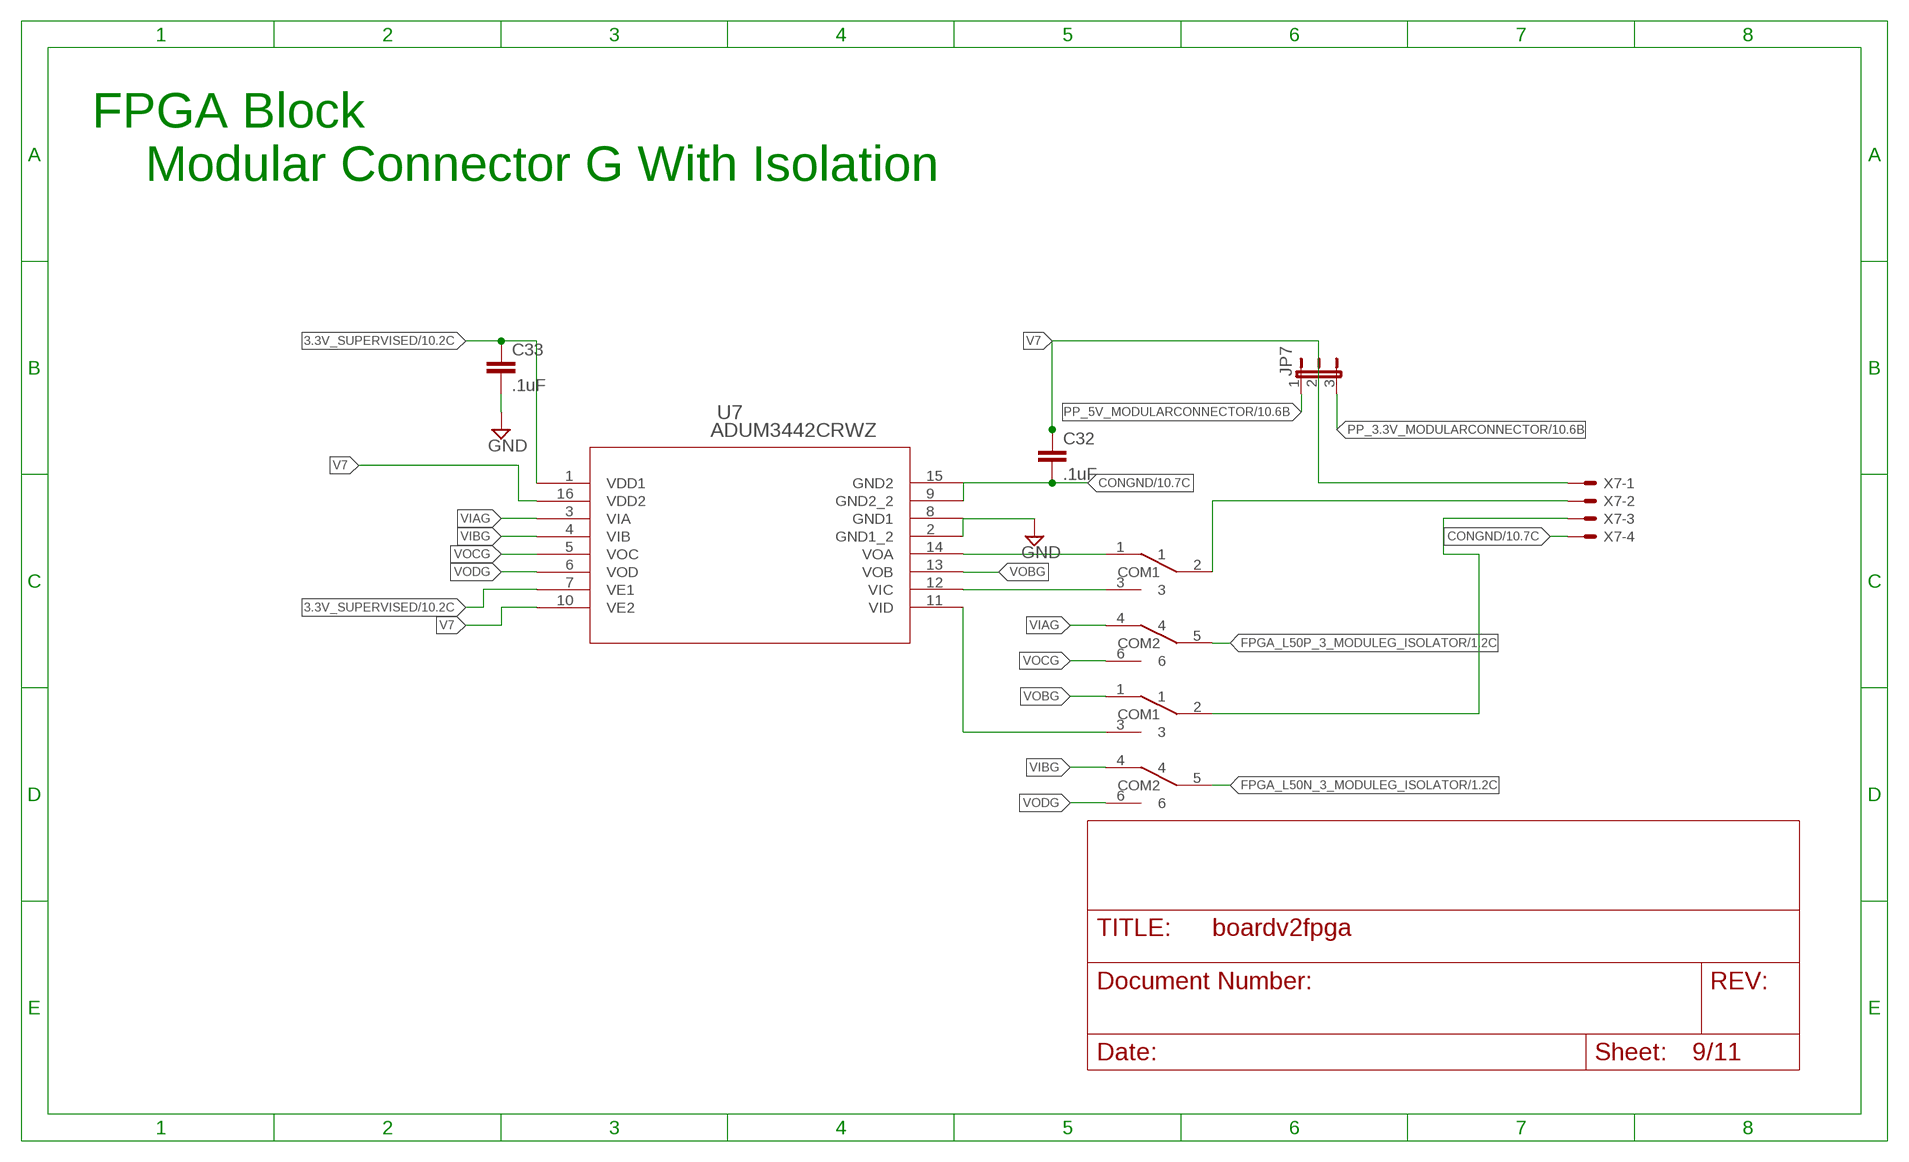
[diagram p9: schematic, sheet 9]

### Parts
C32  .1uF  CAP0603-CAP  [0603-CAP]
C33  .1uF  CAP0603-CAP  [0603-CAP]
JP7  JP2E  [JP2]
U7  ADUM3442CRWZ  [RW_16]
U$16  DPDTSWITCH  [JS202011]
U$17  DPDTSWITCH  [JS202011]
X7  KK-156-4  [KK-156-4]

### Nets
3.3V_SUPERVISED: C33.1 U7.1(VDD1) U7.7(VE1) ; also sheet 3,4,5,6,7,8,10
CONGND: C32.2 U7.9(GND2_2) U7.15(GND2) X7.4 ; also sheet 3,4,5,6,7,8,10
FPGA_L50N_3_MODULEG_ISOLATOR: U$16.5(COM2) ; also sheet 1
FPGA_L50P_3_MODULEG_ISOLATOR: U$17.5(COM2) ; also sheet 1
GND: C33.2 U7.2(GND1_2) U7.8(GND1) ; also sheet 1,2,3,4,5,6,7,8,10
N$31: U$17.2(COM1) X7.2
N$32: U$16.2(COM1) X7.3
N$33: U7.14(VOA) U$17.1
N$34: U7.12(VIC) U$17.3
N$35: U7.11(VID) U$16.3
PP_3.3V_MODULARCONNECTOR: JP7.3 ; also sheet 3,4,5,6,7,8,10
PP_5V_MODULARCONNECTOR: JP7.1 ; also sheet 3,4,5,6,7,8,10
V7: C32.1 JP7.2 U7.10(VE2) U7.16(VDD2) X7.1
VIAG: U7.3(VIA) U$17.4
VIBG: U7.4(VIB) U$16.4
VOBG: U7.13(VOB) U$16.1
VOCG: U7.5(VOC) U$17.6
VODG: U7.6(VOD) U$16.6

### Notes on the sheet
- FPGA Block
- Modular Connector G With Isolation

## Sheet 10 of 11
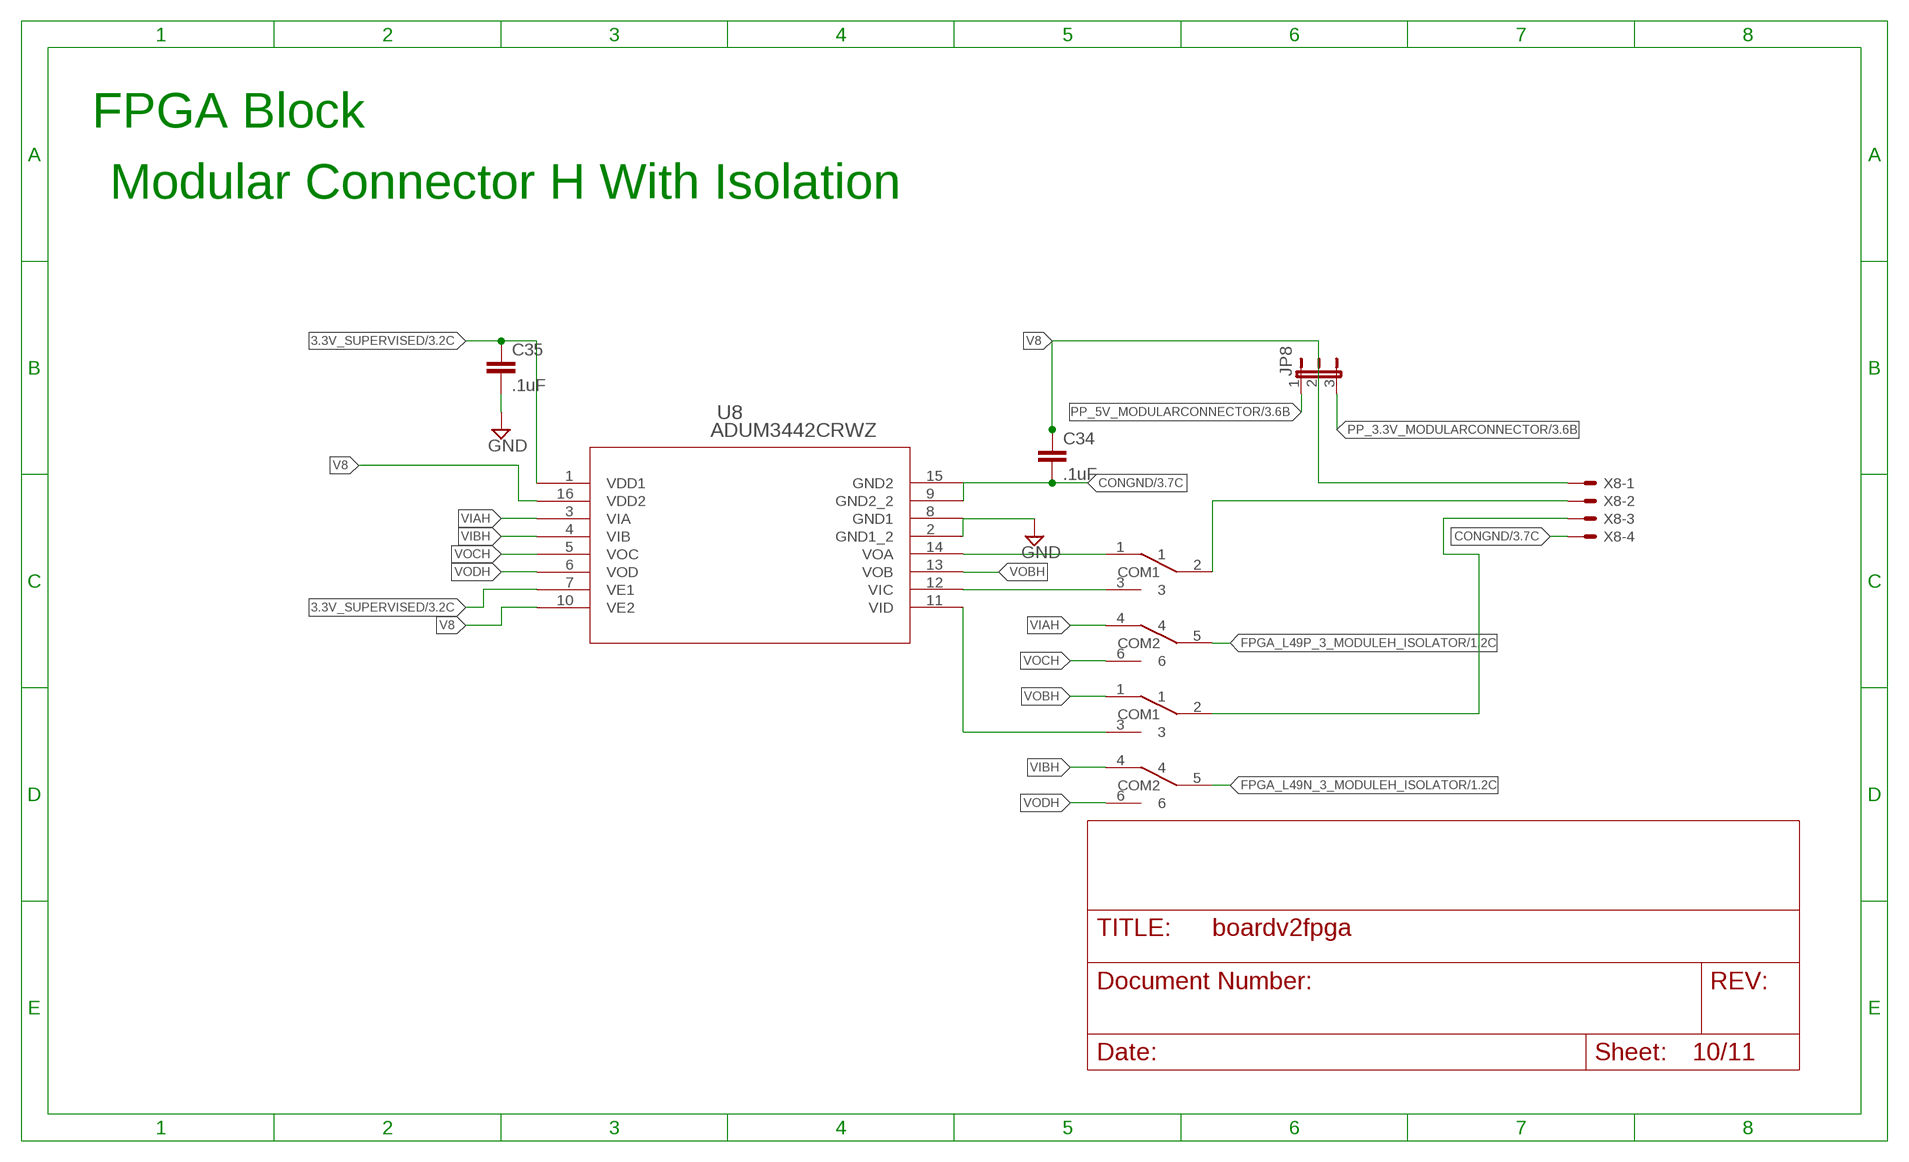
[diagram p10: schematic, sheet 10]

### Parts
C34  .1uF  CAP0603-CAP  [0603-CAP]
C35  .1uF  CAP0603-CAP  [0603-CAP]
JP8  JP2E  [JP2]
U8  ADUM3442CRWZ  [RW_16]
U$18  DPDTSWITCH  [JS202011]
U$19  DPDTSWITCH  [JS202011]
X8  KK-156-4  [KK-156-4]

### Nets
3.3V_SUPERVISED: C35.1 U8.1(VDD1) U8.7(VE1) ; also sheet 3,4,5,6,7,8,9
CONGND: C34.2 U8.9(GND2_2) U8.15(GND2) X8.4 ; also sheet 3,4,5,6,7,8,9
FPGA_L49N_3_MODULEH_ISOLATOR: U$18.5(COM2) ; also sheet 1
FPGA_L49P_3_MODULEH_ISOLATOR: U$19.5(COM2) ; also sheet 1
GND: C35.2 U8.2(GND1_2) U8.8(GND1) ; also sheet 1,2,3,4,5,6,7,8,9
N$36: U$19.2(COM1) X8.2
N$37: U$18.2(COM1) X8.3
N$38: U8.14(VOA) U$19.1
N$39: U8.12(VIC) U$19.3
N$40: U8.11(VID) U$18.3
PP_3.3V_MODULARCONNECTOR: JP8.3 ; also sheet 3,4,5,6,7,8,9
PP_5V_MODULARCONNECTOR: JP8.1 ; also sheet 3,4,5,6,7,8,9
V8: C34.1 JP8.2 U8.10(VE2) U8.16(VDD2) X8.1
VIAH: U8.3(VIA) U$19.4
VIBH: U8.4(VIB) U$18.4
VOBH: U8.13(VOB) U$18.1
VOCH: U8.5(VOC) U$19.6
VODH: U8.6(VOD) U$18.6

### Notes on the sheet
- FPGA Block
- Modular Connector H With Isolation

## Sheet 11 of 11
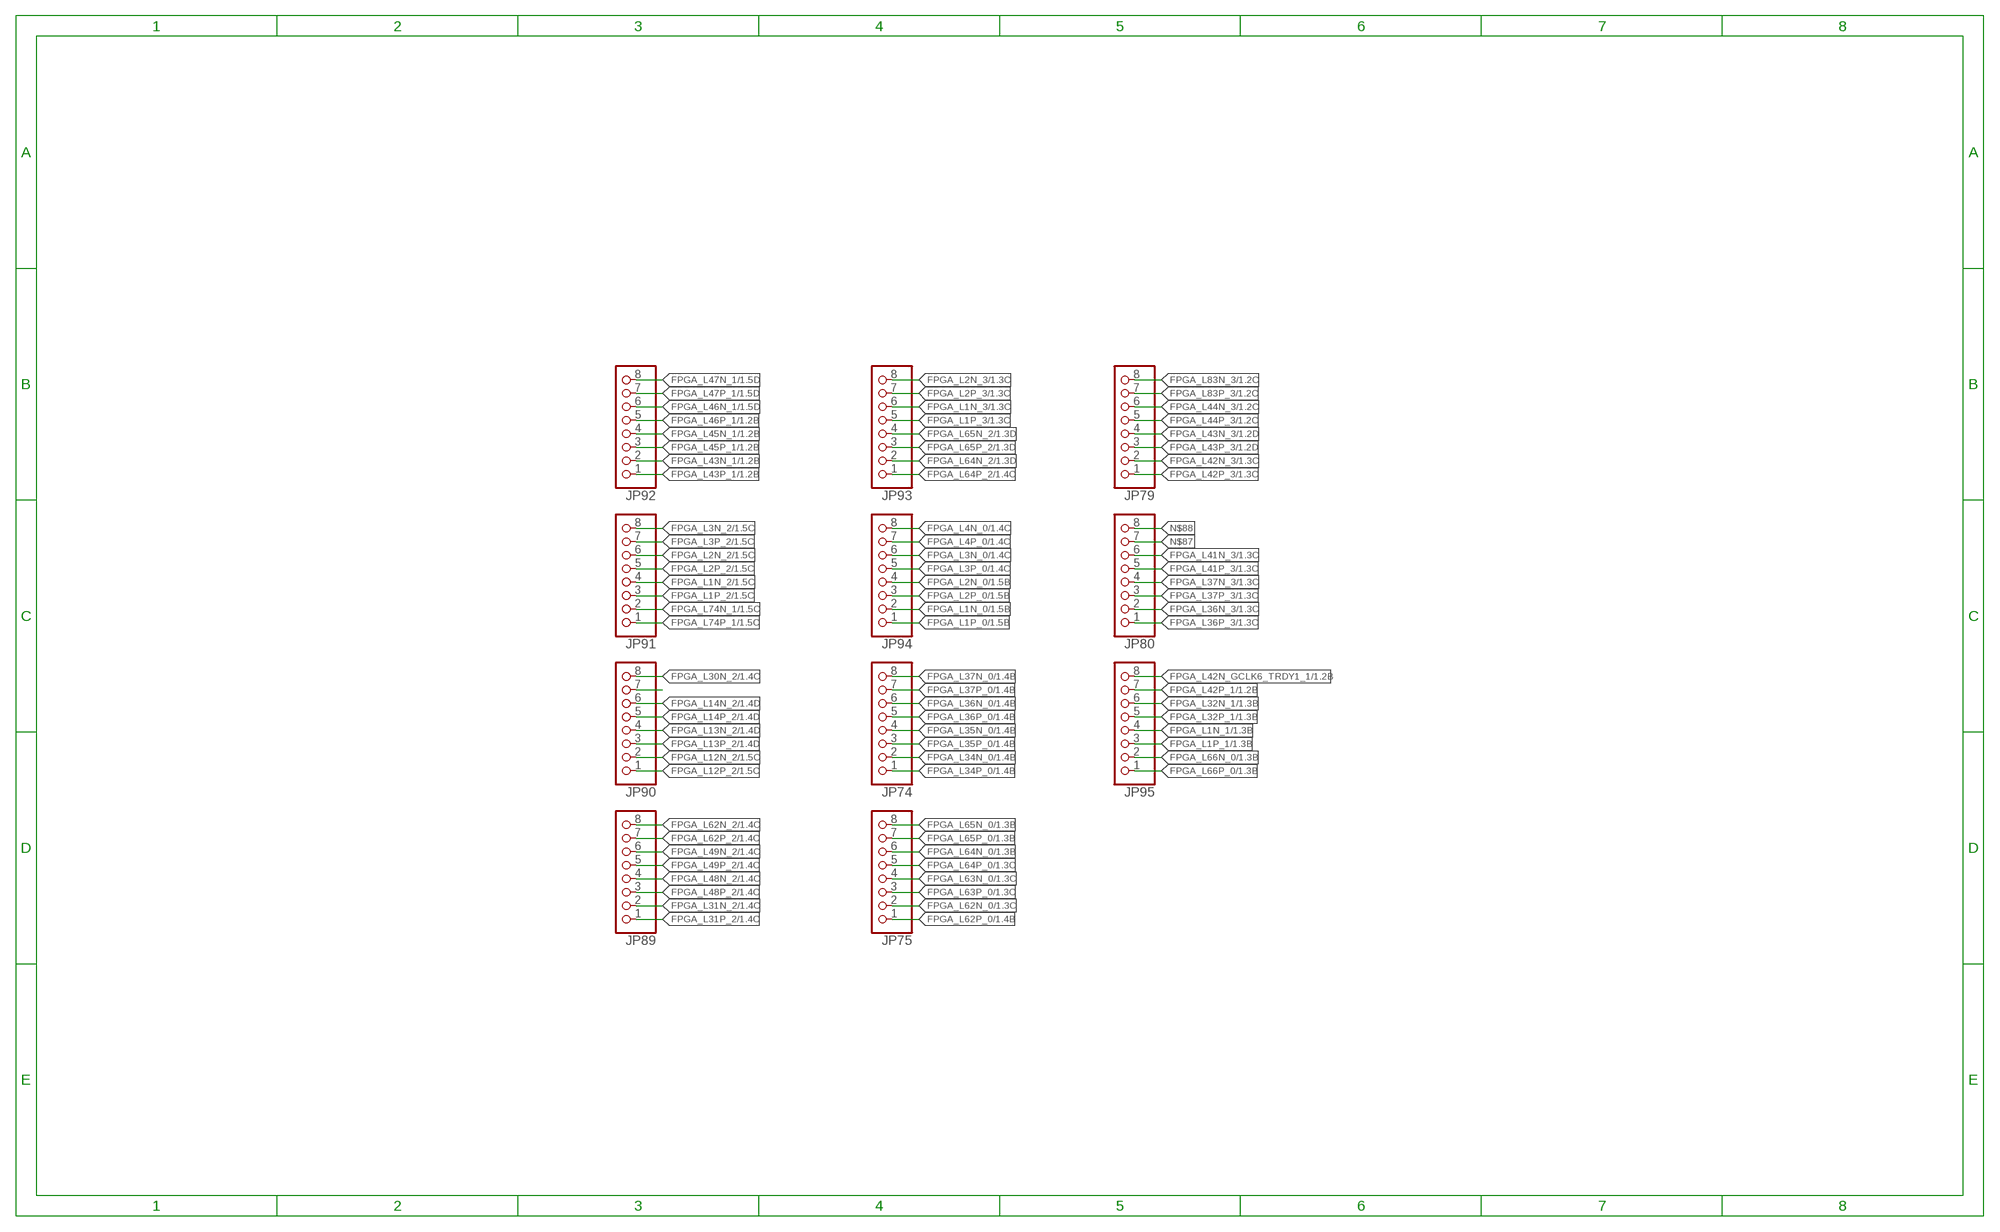
[diagram p11: schematic, sheet 11]

### Parts
JP74  PINHD-1X8  [1X08]
JP75  PINHD-1X8  [1X08]
JP79  PINHD-1X8  [1X08]
JP80  PINHD-1X8  [1X08]
JP89  PINHD-1X8  [1X08]
JP90  PINHD-1X8  [1X08]
JP91  PINHD-1X8  [1X08]
JP92  PINHD-1X8  [1X08]
JP93  PINHD-1X8  [1X08]
JP94  PINHD-1X8  [1X08]
JP95  PINHD-1X8  [1X08]

### Nets
FPGA_L1N_0: JP94.2 ; also sheet 1
FPGA_L1N_1: JP95.4 ; also sheet 1
FPGA_L1N_2: JP91.4 ; also sheet 1
FPGA_L1N_3: JP93.6 ; also sheet 1
FPGA_L1P_0: JP94.1 ; also sheet 1
FPGA_L1P_1: JP95.3 ; also sheet 1
FPGA_L1P_2: JP91.3 ; also sheet 1
FPGA_L1P_3: JP93.5 ; also sheet 1
FPGA_L2N_0: JP94.4 ; also sheet 1
FPGA_L2N_2: JP91.6 ; also sheet 1
FPGA_L2N_3: JP93.8 ; also sheet 1
FPGA_L2P_0: JP94.3 ; also sheet 1
FPGA_L2P_2: JP91.5 ; also sheet 1
FPGA_L2P_3: JP93.7 ; also sheet 1
FPGA_L3N_0: JP94.6 ; also sheet 1
FPGA_L3N_2: JP91.8 ; also sheet 1
FPGA_L3P_0: JP94.5 ; also sheet 1
FPGA_L3P_2: JP91.7 ; also sheet 1
FPGA_L4N_0: JP94.8 ; also sheet 1
FPGA_L4P_0: JP94.7 ; also sheet 1
FPGA_L12N_2: JP90.2 ; also sheet 1
FPGA_L12P_2: JP90.1 ; also sheet 1
FPGA_L13N_2: JP90.4 ; also sheet 1
FPGA_L13P_2: JP90.3 ; also sheet 1
FPGA_L14N_2: JP90.6 ; also sheet 1
FPGA_L14P_2: JP90.5 ; also sheet 1
FPGA_L30N_2: JP90.8 ; also sheet 1
FPGA_L31N_2: JP89.2 ; also sheet 1
FPGA_L31P_2: JP89.1 ; also sheet 1
FPGA_L32N_1: JP95.6 ; also sheet 1
FPGA_L32P_1: JP95.5 ; also sheet 1
FPGA_L34N_0: JP74.2 ; also sheet 1
FPGA_L34P_0: JP74.1 ; also sheet 1
FPGA_L35N_0: JP74.4 ; also sheet 1
FPGA_L35P_0: JP74.3 ; also sheet 1
FPGA_L36N_0: JP74.6 ; also sheet 1
FPGA_L36N_3: JP80.2 ; also sheet 1
FPGA_L36P_0: JP74.5 ; also sheet 1
FPGA_L36P_3: JP80.1 ; also sheet 1
FPGA_L37N_0: JP74.8 ; also sheet 1
FPGA_L37N_3: JP80.4 ; also sheet 1
FPGA_L37P_0: JP74.7 ; also sheet 1
FPGA_L37P_3: JP80.3 ; also sheet 1
FPGA_L41N_3: JP80.6 ; also sheet 1
FPGA_L41P_3: JP80.5 ; also sheet 1
FPGA_L42N_3: JP79.2 ; also sheet 1
FPGA_L42N_GCLK6_TRDY1_1: JP95.8 ; also sheet 1
FPGA_L42P_1: JP95.7 ; also sheet 1
FPGA_L42P_3: JP79.1 ; also sheet 1
FPGA_L43N_1: JP92.2 ; also sheet 1
FPGA_L43N_3: JP79.4 ; also sheet 1
FPGA_L43P_1: JP92.1 ; also sheet 1
FPGA_L43P_3: JP79.3 ; also sheet 1
FPGA_L44N_3: JP79.6 ; also sheet 1
FPGA_L44P_3: JP79.5 ; also sheet 1
FPGA_L45N_1: JP92.4 ; also sheet 1
FPGA_L45P_1: JP92.3 ; also sheet 1
FPGA_L46N_1: JP92.6 ; also sheet 1
FPGA_L46P_1: JP92.5 ; also sheet 1
FPGA_L47N_1: JP92.8 ; also sheet 1
FPGA_L47P_1: JP92.7 ; also sheet 1
FPGA_L48N_2: JP89.4 ; also sheet 1
FPGA_L48P_2: JP89.3 ; also sheet 1
FPGA_L49N_2: JP89.6 ; also sheet 1
FPGA_L49P_2: JP89.5 ; also sheet 1
FPGA_L62N_0: JP75.2 ; also sheet 1
FPGA_L62N_2: JP89.8 ; also sheet 1
FPGA_L62P_0: JP75.1 ; also sheet 1
FPGA_L62P_2: JP89.7 ; also sheet 1
FPGA_L63N_0: JP75.4 ; also sheet 1
FPGA_L63P_0: JP75.3 ; also sheet 1
FPGA_L64N_0: JP75.6 ; also sheet 1
FPGA_L64N_2: JP93.2 ; also sheet 1
FPGA_L64P_0: JP75.5 ; also sheet 1
FPGA_L64P_2: JP93.1 ; also sheet 1
FPGA_L65N_0: JP75.8 ; also sheet 1
FPGA_L65N_2: JP93.4 ; also sheet 1
FPGA_L65P_0: JP75.7 ; also sheet 1
FPGA_L65P_2: JP93.3 ; also sheet 1
FPGA_L66N_0: JP95.2 ; also sheet 1
FPGA_L66P_0: JP95.1 ; also sheet 1
FPGA_L74N_1: JP91.2 ; also sheet 1
FPGA_L74P_1: JP91.1 ; also sheet 1
FPGA_L83N_3: JP79.8 ; also sheet 1
FPGA_L83P_3: JP79.7 ; also sheet 1
N$87: JP80.7
N$88: JP80.8
NC: JP90.7

## Power pins joined to a net without a drawn wire
VCC: Q1.4(VCC)

## Library data of the parts
C1-C35 = SparkFun-Capacitors:CAP: Capacitor Standard 0603 ceramic capacitor, and 0.1" leaded capacitor.
JP1-JP8 = jumper:JP2E: JUMPER
JP74 JP75 JP79 JP80 JP89-JP95 = pinhead:PINHD-1X8: PIN HEADER
Q1 = crystal:ASF*: CRYSTAL CLOCK OSCILLATORS 5.0 Vdc or 3.3 Vdc - LOW PROFILE ULTRA MINIATURE CERAMIC SURFACE MOUNT Source: http://www.abracon.com/Oscillators/asf1-L-L1.pdf; MF: Abracon Corporation; MPN: ASFL1-125.000MHZ-EC-T; OC_FARNELL: 1838931; OC_NEWARK: 19M1882
R33 = SparkFun-Passives:RESISTOR: Resistor Basic schematic elements and footprints for 0603, 1206, and PTH resistors.
U1-U8 = digital-isolator:ADUM3442CRWZ
U$1 = xilinx_devices_V6:XC6SLX4-2TQG144C
U$2 = connectors:JTAG14PIN
U$3 = shit:1.2VREG
U$4-U$19 = shit:DPDTSWITCH
X1-X8 = con-molex:KK-156-4: KK 156 HEADER Source: http://www.molex.com/pdm_docs/sd/026604100_sd.pdf; OC_FARNELL: unknown; OC_NEWARK: unknown